# EAGLE design EPS (EAGLE 9.5.1)

## Sheet 1 of 11
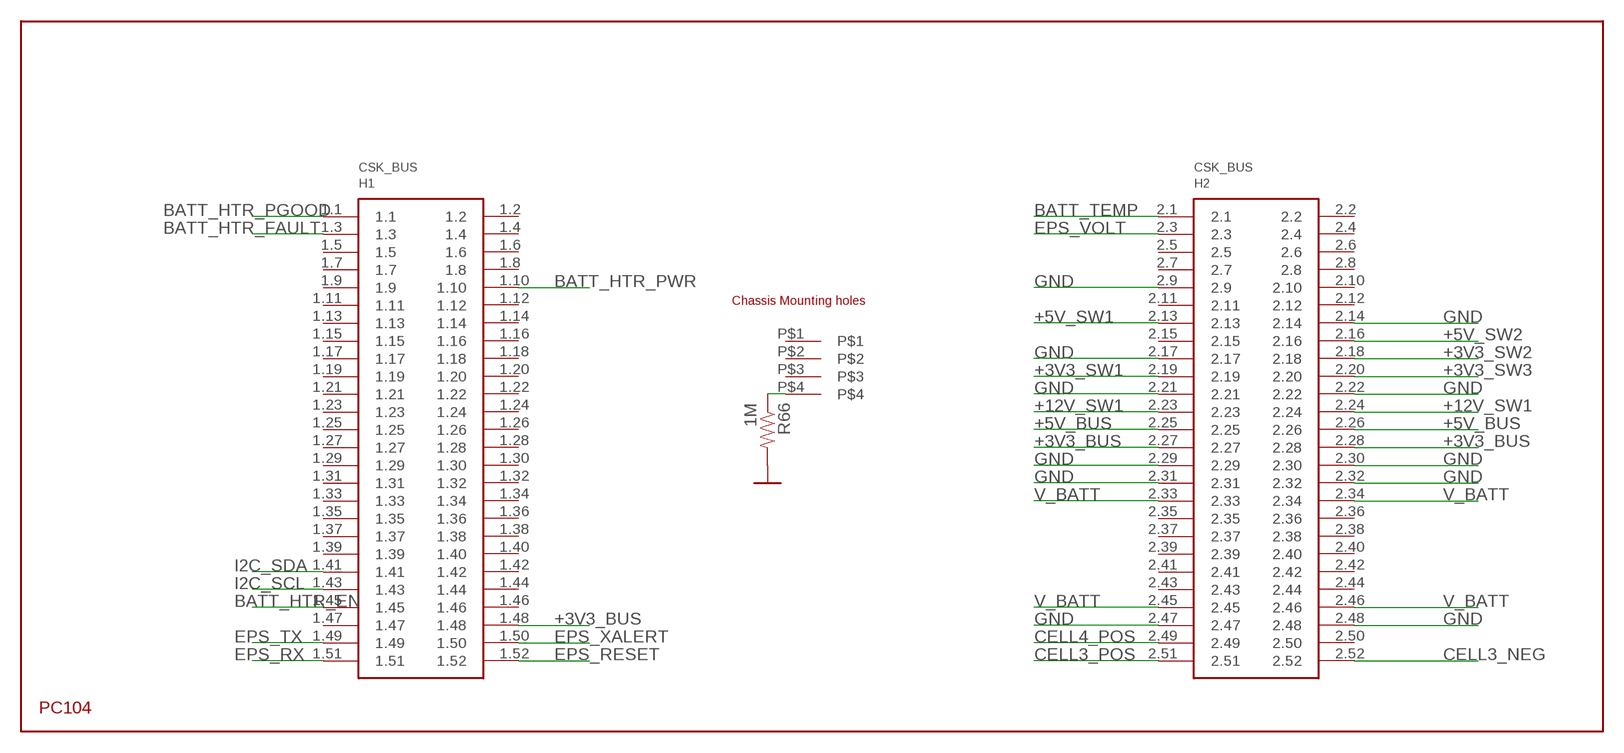
[diagram p0: schematic, sheet 1]

### Parts
H1  PC104_WCONN  [PC104_WCONN]
R66  1M  RESISTOR0805-RES  [0805]

### Nets
+3V3_BUS: H1.1.48 H1.2.27 H1.2.28 ; also sheet 6,8
+3V3_SW1: H1.2.19 ; also sheet 7
+3V3_SW2: H1.2.18 ; also sheet 10
+3V3_SW3: H1.2.20 ; also sheet 11
+5V_BUS: H1.2.25 H1.2.26 ; also sheet 4,8
+5V_SW1: H1.2.13 ; also sheet 5
+5V_SW2: H1.2.16 ; also sheet 9
+12V_SW1: H1.2.23 H1.2.24 ; also sheet 3
BATT_HTR_EN: H1.1.45 ; also sheet 8
BATT_HTR_FAULT: H1.1.3 ; also sheet 8
BATT_HTR_PGOOD: H1.1.1 ; also sheet 8
BATT_HTR_PWR: H1.1.10
BATT_TEMP: H1.2.1 ; also sheet 8
CELL3_NEG: H1.2.52
CELL3_POS: H1.2.51
CELL4_POS: H1.2.49
EPS_RESET: H1.1.52 ; also sheet 8
EPS_RX: H1.1.51 ; also sheet 8
EPS_TX: H1.1.49 ; also sheet 8
EPS_VOLT: H1.2.3 ; also sheet 8
EPS_XALERT: H1.1.50 ; also sheet 8
GND: H1.2.9 H1.2.14 H1.2.17 H1.2.21 H1.2.22 H1.2.29 H1.2.30 H1.2.31 H1.2.32 H1.2.47 H1.2.48 R66.2 ; also sheet 2,3,4,5,6,7,8,9,10,11
I2C_SCL: H1.1.43 ; also sheet 8
I2C_SDA: H1.1.41 ; also sheet 8
N$94: H1.P$4 R66.1
V_BATT: H1.2.33 H1.2.34 H1.2.45 H1.2.46 ; also sheet 2,3,4,5,6,7,9,10,11
Unconnected: H1.1.2 H1.1.4 H1.1.5 H1.1.6 H1.1.7 H1.1.8 H1.1.9 H1.1.11 H1.1.12 H1.1.13 H1.1.14 H1.1.15 H1.1.16 H1.1.17 H1.1.18 H1.1.19 H1.1.20 H1.1.21 H1.1.22 H1.1.23 H1.1.24 H1.1.25 H1.1.26 H1.1.27 H1.1.28 H1.1.29 H1.1.30 H1.1.31 H1.1.32 H1.1.33 H1.1.34 H1.1.35 H1.1.36 H1.1.37 H1.1.38 H1.1.39 H1.1.40 H1.1.42 H1.1.44 H1.1.46 H1.1.47 H1.2.2 H1.2.4 H1.2.5 H1.2.6 H1.2.7 H1.2.8 H1.2.10 H1.2.11 H1.2.12 H1.2.15 H1.2.35 H1.2.36 H1.2.37 H1.2.38 H1.2.39 H1.2.40 H1.2.41 H1.2.42 H1.2.43 H1.2.44 H1.2.50 H1.P$1 H1.P$2 H1.P$3

## Sheet 2 of 11
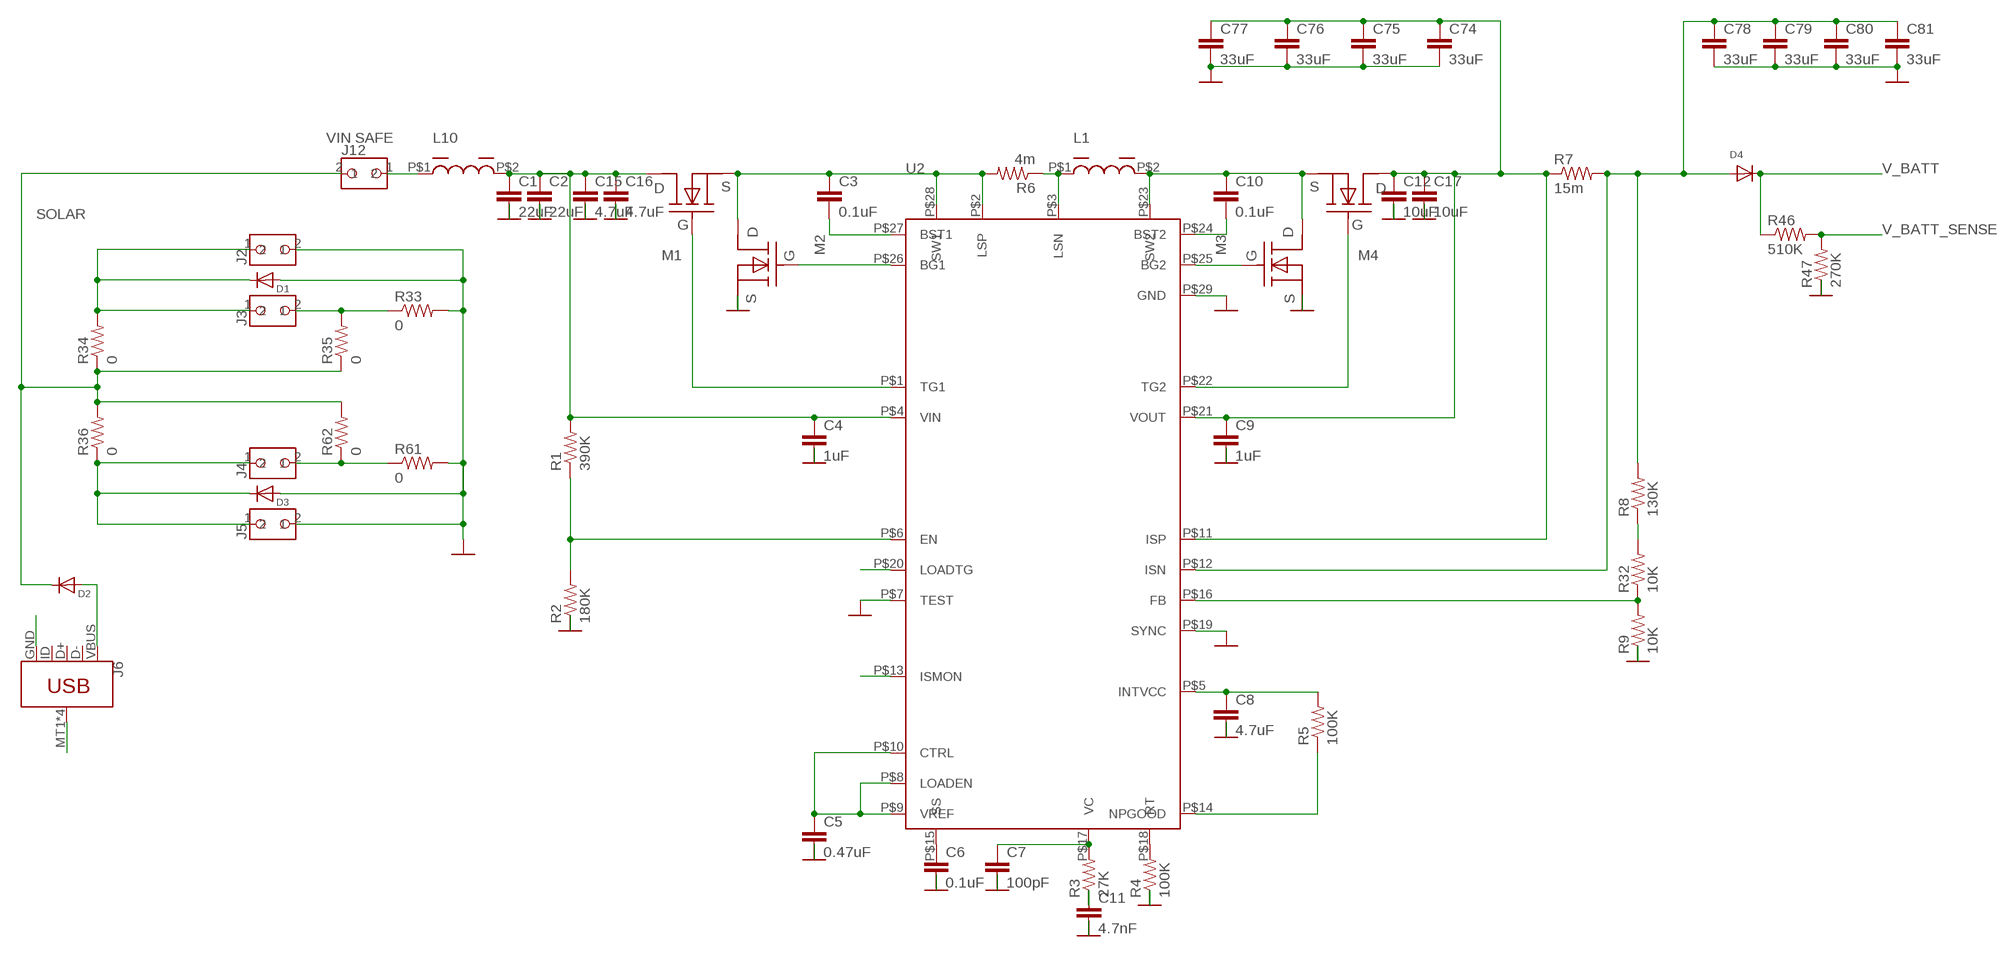
[diagram p1: schematic, sheet 2]

### Parts
C1  22uF  CAP0805  [0805]
C2  22uF  CAP0805  [0805]
C3  0.1uF  CAP0805  [0805]
C4  1uF  CAP0805  [0805]
C5  0.47uF  CAP0805  [0805]
C6  0.1uF  CAP0805  [0805]
C7  100pF  CAP0805  [0805]
C8  4.7uF  CAP0805  [0805]
C9  1uF  CAP0805  [0805]
C10  0.1uF  CAP0805  [0805]
C11  4.7nF  CAP0805  [0805]
C12  10uF  CAP0805  [0805]
C15  4.7uF  CAP0805  [0805]
C16  4.7uF  CAP0805  [0805]
C17  10uF  CAP0805  [0805]
C74  33uF  CAP1206  [1206]
C75  33uF  CAP1206  [1206]
C76  33uF  CAP1206  [1206]
C77  33uF  CAP1206  [1206]
C78  33uF  CAP1206  [1206]
C79  33uF  CAP1206  [1206]
C80  33uF  CAP1206  [1206]
C81  33uF  CAP1206  [1206]
D1  DIODE_SOD-123FL  [SOD-123FL]
D2  DIODE_SOD-123FL  [SOD-123FL]
D3  DIODE_SOD-123FL  [SOD-123FL]
D4  DIODE_SOD-123FL  [SOD-123FL]
J2  2PIN_HEADER  [2MM_2PIN_HEADER]
J3  2PIN_HEADER  [2MM_2PIN_HEADER]
J4  2PIN_HEADER  [2MM_2PIN_HEADER]
J5  2PIN_HEADER  [2MM_2PIN_HEADER]
J6  USB_MICRO-B_SMT  [USB-MICROB]
J12  2PIN_HEADER  [2MM_2PIN_HEADER]
L1  6uH  7443551600  [7443551600]
L10  6uH  7443551600  [7443551600]
M1  BSZ100N06LS3  [BSZ100N06LS3]
M2  BSZ100N06LS3  [BSZ100N06LS3]
M3  BSZ033NE2LS5  BSZ100N06LS3  [BSZ100N06LS3]
M4  BSZ033NE2LS5  BSZ100N06LS3  [BSZ100N06LS3]
R1  390K  RESISTOR0805-RES  [0805]
R2  180K  RESISTOR0805-RES  [0805]
R3  27K  RESISTOR0805-RES  [0805]
R4  100K  RESISTOR0805-RES  [0805]
R5  100K  RESISTOR0805-RES  [0805]
R6  4m  RESISTOR0805-RES  [0805]
R7  15m  RESISTOR0805-RES  [0805]
R8  130K  RESISTOR0805-RES  [0805]
R9  10K  RESISTOR0805-RES  [0805]
R32  10K  RESISTOR0805-RES  [0805]
R33  0  RESISTOR0603-RES  [0603-RES]
R34  0  RESISTOR0603-RES  [0603-RES]
R35  0  RESISTOR0603-RES  [0603-RES]
R36  0  RESISTOR0603-RES  [0603-RES]
R46  510K  RESISTOR0805-RES  [0805]
R47  270K  RESISTOR0805-RES  [0805]
R61  0  RESISTOR0603-RES  [0603-RES]
R62  0  RESISTOR0603-RES  [0603-RES]
U2  LT8390UFD  [LT8390UFD]

### Nets
GND: C1.2 C2.2 C4.2 C5.2 C6.2 C7.2 C8.2 C9.2 C11.2 C12.2 C15.2 C16.2 C17.2 C74.2 C75.2 C76.2 C77.2 C78.2 C79.2 C80.2 C81.2 D1.A D3.A J2.2 J5.2 J6.GND J6.MT1(SHIELD) J6.MT2(SHIELD) J6.P$1(SHIELD) J6.P$2(SHIELD) M2.P$2(S) M2.P$3(S) M2.P$4(S) M3.P$2(S) M3.P$3(S) M3.P$4(S) R2.1 R4.1 R9.1 R33.2 R47.1 R61.2 U2.P$7(TEST) U2.P$19(SYNC) U2.P$29(GND) ; also sheet 1,3,4,5,6,7,8,9,10,11
N$1: C3.1 M1.P$2(S) M1.P$3(S) M1.P$4(S) M2.P$5(D) M2.P$6(D) M2.P$7(D) M2.P$8(D) M2.P$9(D) R6.2 U2.P$2(LSP) U2.P$28(SW1)
N$2: C3.2 U2.P$27(BST1)
N$15: R8.1 R32.2
N$17: M2.P$1(G) U2.P$26(BG1)
N$34: M1.P$1(G) U2.P$1(TG1)
N$35: M3.P$1(G) U2.P$25(BG2)
N$36: R1.1 R2.2 U2.P$6(EN)
N$37: U2.P$20(LOADTG)
N$38: U2.P$13(ISMON)
N$39: C5.1 U2.P$8(LOADEN) U2.P$9(VREF) U2.P$10(CTRL)
N$40: C6.1 U2.P$15(SS)
N$41: C7.1 R3.2 U2.P$17(VC)
N$42: R4.2 U2.P$18(RT)
N$43: R5.1 U2.P$14(NPGOOD)
N$44: C8.1 R5.2 U2.P$5(INTVCC)
N$45: L1.P$1 R6.1 U2.P$3(LSN)
N$46: C10.1 L1.P$2 M3.P$5(D) M3.P$6(D) M3.P$7(D) M3.P$8(D) M3.P$9(D) M4.P$2(S) M4.P$3(S) M4.P$4(S) U2.P$23(SW2)
N$47: C10.2 U2.P$24(BST2)
N$48: C9.1 C12.1 C17.1 C74.1 C75.1 C76.1 C77.1 M4.P$5(D) M4.P$6(D) M4.P$7(D) M4.P$8(D) M4.P$9(D) R7.1 U2.P$11(ISP) U2.P$21(VOUT)
N$49: M4.P$1(G) U2.P$22(TG2)
N$50: J12.1 L10.P$1
N$51: R9.2 R32.1 U2.P$16(FB)
N$52: D1.C J2.1 J3.1 R34.2
N$53: J3.2 R33.1 R35.2
N$55: C11.1 R3.1
N$57: J4.2 R61.1 R62.1
N$58: D2.A J6.VBUS
N$85: C1.1 C2.1 C4.1 C15.1 C16.1 L10.P$2 M1.P$5(D) M1.P$6(D) M1.P$7(D) M1.P$8(D) M1.P$9(D) R1.2 U2.P$4(VIN)
N$99: D3.C J4.1 J5.1 R36.1
SOLAR: D2.C J12.2 R34.1 R35.1 R36.2 R62.2
V_BATT: C78.1 C79.1 C80.1 C81.1 D4.A D4.C R7.2 R8.2 R46.1 U2.P$12(ISN) ; also sheet 1,3,4,5,6,7,9,10,11
V_BATT_SENSE: R46.2 R47.2 ; also sheet 8
Unconnected: J6.D+ J6.D- J6.ID

### Notes on the sheet
- VIN SAFE

## Sheet 3 of 11
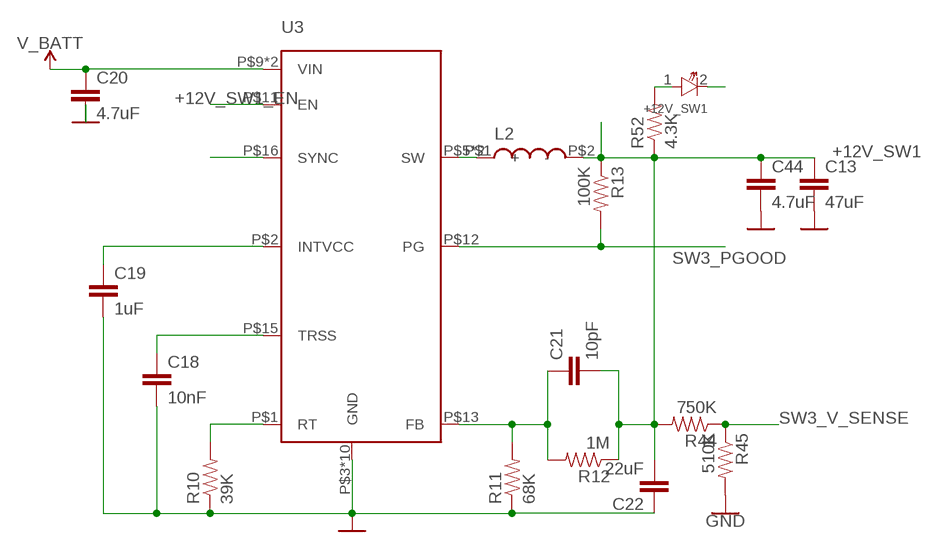
[diagram p2: schematic, sheet 3]

### Parts
+12V_SW1  LED_0805  [LED_0805]
C13  47uF  CAP1206  [1206]
C18  10nF  CAP0805  [0805]
C19  1uF  CAP0805  [0805]
C20  4.7uF  CAP0805  [0805]
C21  10pF  CAP0805  [0805]
C22  22uF  CAP0805  [0805]
C44  4.7uF  CAP0805  [0805]
L2  10uH  XAL4040-103ME  [XAL4040-103ME]
R10  39K  RESISTOR0805-RES  [0805]
R11  68K  RESISTOR0805-RES  [0805]
R12  1M  RESISTOR0805-RES  [0805]
R13  100K  RESISTOR0805-RES  [0805]
R44  750K  RESISTOR0805-RES  [0805]
R45  510K  RESISTOR0805-RES  [0805]
R52  4.3K  RESISTOR0805-RES  [0805]
U3  LT8609S  [LT8609S]

### Nets
+12V_SW1: C13.1 C21.2 C22.2 C44.1 L2.P$2(-) R12.1 R13.1 R44.2 R52.1 ; also sheet 1
+12V_SW1_EN: U3.P$11(EN) ; also sheet 8
GND: +12V_SW1.2 C13.2 C18.2 C19.2 C20.2 C22.1 C44.2 R10.1 R11.1 R45.2 U3.P$3(GND) U3.P$4(GND) U3.P$7(GND) U3.P$8(GND) U3.P$14(GND) U3.P$17(GND) U3.P$18(GND) U3.P$19(GND) U3.P$20(GND) U3.P$21(GND) ; also sheet 1,2,4,5,6,7,8,9,10,11
N$4: L2.P$1(+) U3.P$5(SW) U3.P$6(SW)
N$5: U3.P$16(SYNC)
N$6: R10.2 U3.P$1(RT)
N$7: C21.1 R11.2 R12.2 U3.P$13(FB)
N$9: C19.1 U3.P$2(INTVCC)
N$10: C18.1 U3.P$15(TRSS)
N$56: +12V_SW1.1 R52.2
SW3_PGOOD: R13.2 U3.P$12(PG)
SW3_V_SENSE: R44.1 R45.1 ; also sheet 8
V_BATT: C20.1 U3.P$9(VIN) U3.P$10(VIN) ; also sheet 1,2,4,5,6,7,9,10,11

## Sheet 4 of 11
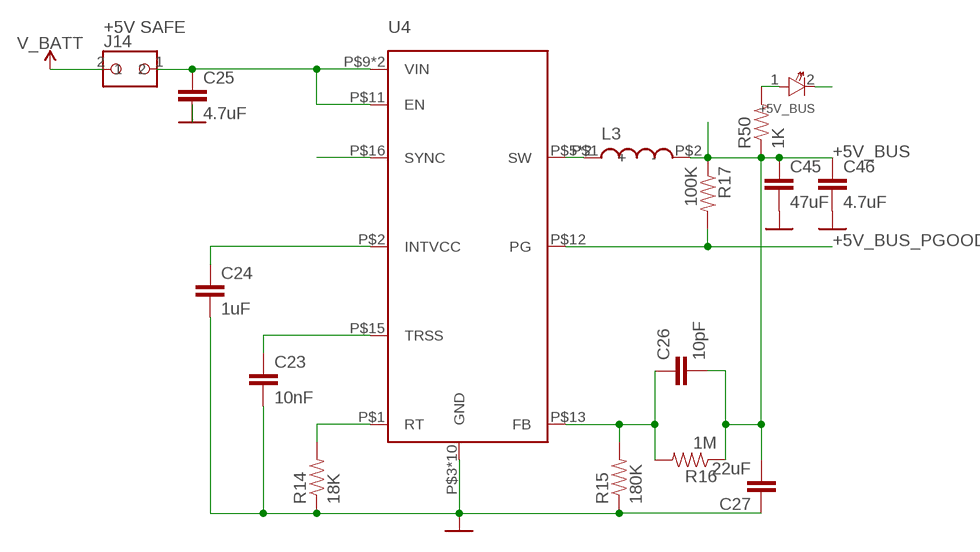
[diagram p3: schematic, sheet 4]

### Parts
+5V_BUS  LED_0805  [LED_0805]
C23  10nF  CAP0805  [0805]
C24  1uF  CAP0805  [0805]
C25  4.7uF  CAP0805  [0805]
C26  10pF  CAP0805  [0805]
C27  22uF  CAP0805  [0805]
C45  47uF  CAP0805  [0805]
C46  4.7uF  CAP0805  [0805]
J14  2PIN_HEADER  [2MM_2PIN_HEADER]
L3  2.2uH  XFL4020-222ME  [XAL4040-103ME]
R14  18K  RESISTOR0805-RES  [0805]
R15  180K  RESISTOR0805-RES  [0805]
R16  1M  RESISTOR0805-RES  [0805]
R17  100K  RESISTOR0805-RES  [0805]
R50  1K  RESISTOR0805-RES  [0805]
U4  LT8609S  [LT8609S]

### Nets
+5V_BUS: C26.2 C27.2 C45.1 C46.1 L3.P$2(-) R16.1 R17.1 R50.1 ; also sheet 1,8
+5V_BUS_PGOOD: R17.2 U4.P$12(PG)
GND: +5V_BUS.2 C23.2 C24.2 C25.2 C27.1 C45.2 C46.2 R14.1 R15.1 U4.P$3(GND) U4.P$4(GND) U4.P$7(GND) U4.P$8(GND) U4.P$14(GND) U4.P$17(GND) U4.P$18(GND) U4.P$19(GND) U4.P$20(GND) U4.P$21(GND) ; also sheet 1,2,3,5,6,7,8,9,10,11
N$3: U4.P$16(SYNC)
N$8: R14.2 U4.P$1(RT)
N$11: C26.1 R15.2 R16.2 U4.P$13(FB)
N$12: C24.1 U4.P$2(INTVCC)
N$13: C23.1 U4.P$15(TRSS)
N$14: L3.P$1(+) U4.P$5(SW) U4.P$6(SW)
N$60: +5V_BUS.1 R50.2
V_BATT: J14.2 ; also sheet 1,2,3,5,6,7,9,10,11
V_BUS: C25.1 J14.1 U4.P$9(VIN) U4.P$10(VIN) U4.P$11(EN) ; also sheet 6

### Notes on the sheet
- +5V SAFE

## Sheet 5 of 11
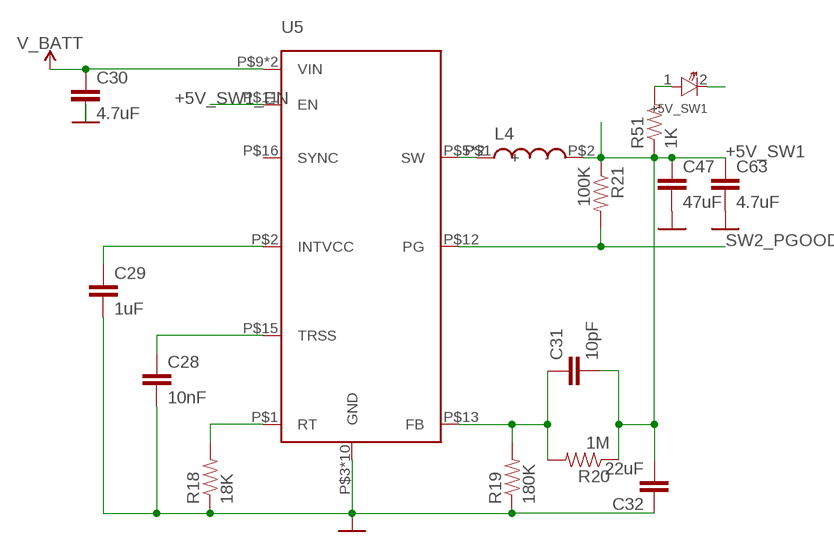
[diagram p4: schematic, sheet 5]

### Parts
+5V_SW1  LED_0805  [LED_0805]
C28  10nF  CAP0805  [0805]
C29  1uF  CAP0805  [0805]
C30  4.7uF  CAP0805  [0805]
C31  10pF  CAP0805  [0805]
C32  22uF  CAP0805  [0805]
C47  47uF  CAP0805  [0805]
C63  4.7uF  CAP0805  [0805]
L4  2.2uH  XFL4020-222ME  [XAL4040-103ME]
R18  18K  RESISTOR0805-RES  [0805]
R19  180K  RESISTOR0805-RES  [0805]
R20  1M  RESISTOR0805-RES  [0805]
R21  100K  RESISTOR0805-RES  [0805]
R51  1K  RESISTOR0805-RES  [0805]
U5  LT8609S  [LT8609S]

### Nets
+5V_SW1: C31.2 C32.2 C47.1 C63.1 L4.P$2(-) R20.1 R21.1 R51.1 ; also sheet 1
+5V_SW1_EN: U5.P$11(EN) ; also sheet 8
GND: +5V_SW1.2 C28.2 C29.2 C30.2 C32.1 C47.2 C63.2 R18.1 R19.1 U5.P$3(GND) U5.P$4(GND) U5.P$7(GND) U5.P$8(GND) U5.P$14(GND) U5.P$17(GND) U5.P$18(GND) U5.P$19(GND) U5.P$20(GND) U5.P$21(GND) ; also sheet 1,2,3,4,6,7,8,9,10,11
N$16: R18.2 U5.P$1(RT)
N$18: C31.1 R19.2 R20.2 U5.P$13(FB)
N$19: C29.1 U5.P$2(INTVCC)
N$20: C28.1 U5.P$15(TRSS)
N$21: L4.P$1(+) U5.P$5(SW) U5.P$6(SW)
N$75: +5V_SW1.1 R51.2
SW2_PGOOD: R21.2 U5.P$12(PG) ; also sheet 8
V_BATT: C30.1 U5.P$9(VIN) U5.P$10(VIN) ; also sheet 1,2,3,4,6,7,9,10,11
Unconnected: U5.P$16(SYNC)

## Sheet 6 of 11
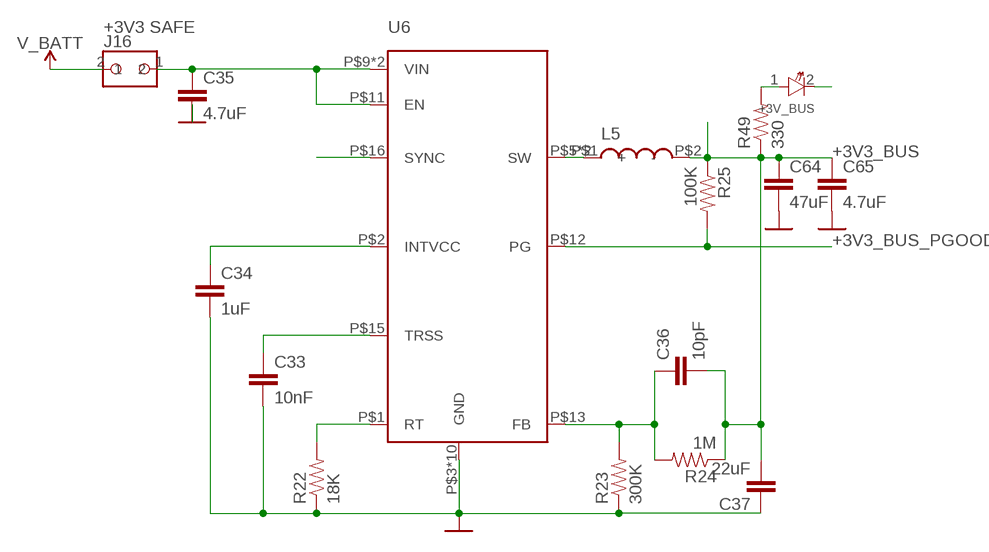
[diagram p5: schematic, sheet 6]

### Parts
+3V_BUS  LED_0805  [LED_0805]
C33  10nF  CAP0805  [0805]
C34  1uF  CAP0805  [0805]
C35  4.7uF  CAP0805  [0805]
C36  10pF  CAP0805  [0805]
C37  22uF  CAP0805  [0805]
C64  47uF  CAP0805  [0805]
C65  4.7uF  CAP0805  [0805]
J16  2PIN_HEADER  [2MM_2PIN_HEADER]
L5  2.2uH  XFL4020-222ME  [XAL4040-103ME]
R22  18K  RESISTOR0805-RES  [0805]
R23  300K  RESISTOR0805-RES  [0805]
R24  1M  RESISTOR0805-RES  [0805]
R25  100K  RESISTOR0805-RES  [0805]
R49  330  RESISTOR0805-RES  [0805]
U6  LT8609S  [LT8609S]

### Nets
+3V3_BUS: C36.2 C37.2 C64.1 C65.1 L5.P$2(-) R24.1 R25.1 R49.1 ; also sheet 1,8
+3V3_BUS_PGOOD: R25.2 U6.P$12(PG)
GND: +3V_BUS.2 C33.2 C34.2 C35.2 C37.1 C64.2 C65.2 R22.1 R23.1 U6.P$3(GND) U6.P$4(GND) U6.P$7(GND) U6.P$8(GND) U6.P$14(GND) U6.P$17(GND) U6.P$18(GND) U6.P$19(GND) U6.P$20(GND) U6.P$21(GND) ; also sheet 1,2,3,4,5,7,8,9,10,11
N$22: U6.P$16(SYNC)
N$23: R22.2 U6.P$1(RT)
N$24: C36.1 R23.2 R24.2 U6.P$13(FB)
N$25: C34.1 U6.P$2(INTVCC)
N$26: C33.1 U6.P$15(TRSS)
N$27: L5.P$1(+) U6.P$5(SW) U6.P$6(SW)
N$84: +3V_BUS.1 R49.2
V_BATT: J16.2 ; also sheet 1,2,3,4,5,7,9,10,11
V_BUS: C35.1 J16.1 U6.P$9(VIN) U6.P$10(VIN) U6.P$11(EN) ; also sheet 4

### Notes on the sheet
- +3V3 SAFE

## Sheet 7 of 11
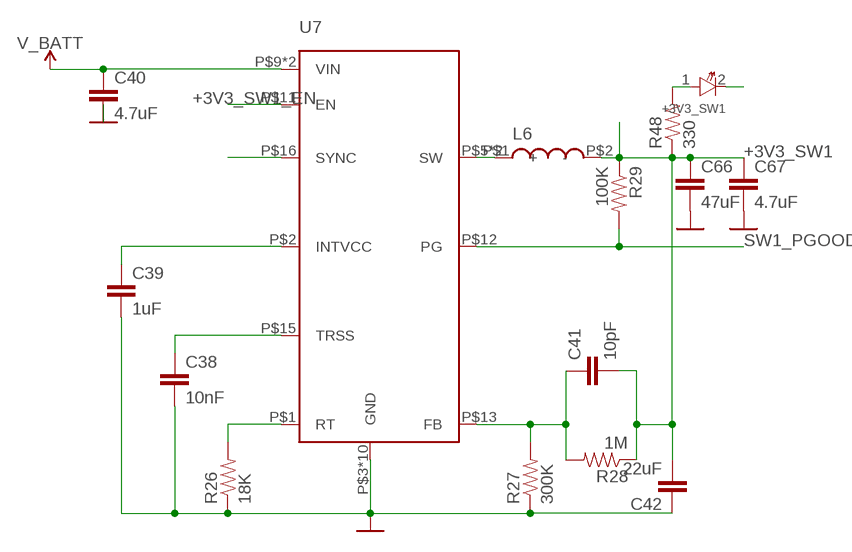
[diagram p6: schematic, sheet 7]

### Parts
+3V3_SW1  LED_0805  [LED_0805]
C38  10nF  CAP0805  [0805]
C39  1uF  CAP0805  [0805]
C40  4.7uF  CAP0805  [0805]
C41  10pF  CAP0805  [0805]
C42  22uF  CAP0805  [0805]
C66  47uF  CAP0805  [0805]
C67  4.7uF  CAP0805  [0805]
L6  2.2uH  XFL4020-222ME  [XAL4040-103ME]
R26  18K  RESISTOR0805-RES  [0805]
R27  300K  RESISTOR0805-RES  [0805]
R28  1M  RESISTOR0805-RES  [0805]
R29  100K  RESISTOR0805-RES  [0805]
R48  330  RESISTOR0805-RES  [0805]
U7  LT8609S  [LT8609S]

### Nets
+3V3_SW1: C41.2 C42.2 C66.1 C67.1 L6.P$2(-) R28.1 R29.1 R48.1 ; also sheet 1
+3V3_SW1_EN: U7.P$11(EN) ; also sheet 8
GND: +3V3_SW1.2 C38.2 C39.2 C40.2 C42.1 C66.2 C67.2 R26.1 R27.1 U7.P$3(GND) U7.P$4(GND) U7.P$7(GND) U7.P$8(GND) U7.P$14(GND) U7.P$17(GND) U7.P$18(GND) U7.P$19(GND) U7.P$20(GND) U7.P$21(GND) ; also sheet 1,2,3,4,5,6,8,9,10,11
N$28: U7.P$16(SYNC)
N$29: R26.2 U7.P$1(RT)
N$30: C41.1 R27.2 R28.2 U7.P$13(FB)
N$31: C39.1 U7.P$2(INTVCC)
N$32: C38.1 U7.P$15(TRSS)
N$33: L6.P$1(+) U7.P$5(SW) U7.P$6(SW)
N$54: +3V3_SW1.1 R48.2
SW1_PGOOD: R29.2 U7.P$12(PG) ; also sheet 8
V_BATT: C40.1 U7.P$9(VIN) U7.P$10(VIN) ; also sheet 1,2,3,4,5,6,9,10,11

## Sheet 8 of 11
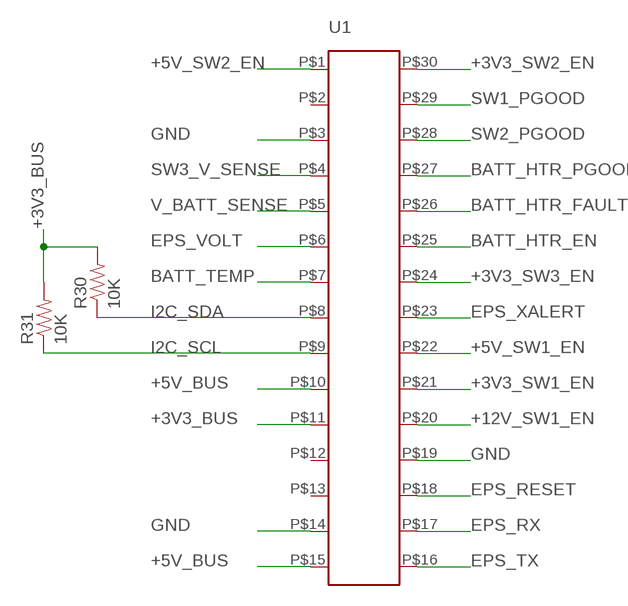
[diagram p7: schematic, sheet 8]

### Parts
R30  10K  RESISTOR0805-RES  [0805]
R31  10K  RESISTOR0805-RES  [0805]
U1  ARDUINO_EVERY_NANO_PAD  [ARDUINO_EVERY_NANO]

### Nets
+3V3_BUS: R30.2 R31.2 U1.P$11 ; also sheet 1,6
+3V3_SW1_EN: U1.P$21 ; also sheet 7
+3V3_SW2_EN: U1.P$30 ; also sheet 10
+3V3_SW3_EN: U1.P$24 ; also sheet 11
+5V_BUS: U1.P$10 U1.P$15 ; also sheet 1,4
+5V_SW1_EN: U1.P$22 ; also sheet 5
+5V_SW2_EN: U1.P$1 ; also sheet 9
+12V_SW1_EN: U1.P$20 ; also sheet 3
BATT_HTR_EN: U1.P$25 ; also sheet 1
BATT_HTR_FAULT: U1.P$26 ; also sheet 1
BATT_HTR_PGOOD: U1.P$27 ; also sheet 1
BATT_TEMP: U1.P$7 ; also sheet 1
EPS_RESET: U1.P$18 ; also sheet 1
EPS_RX: U1.P$17 ; also sheet 1
EPS_TX: U1.P$16 ; also sheet 1
EPS_VOLT: U1.P$6 ; also sheet 1
EPS_XALERT: U1.P$23 ; also sheet 1
GND: U1.P$3 U1.P$14 U1.P$19 ; also sheet 1,2,3,4,5,6,7,9,10,11
I2C_SCL: R31.1 U1.P$9 ; also sheet 1
I2C_SDA: R30.1 U1.P$8 ; also sheet 1
SW1_PGOOD: U1.P$29 ; also sheet 7
SW2_PGOOD: U1.P$28 ; also sheet 5
SW3_V_SENSE: U1.P$4 ; also sheet 3
V_BATT_SENSE: U1.P$5 ; also sheet 2
Unconnected: U1.P$2 U1.P$12 U1.P$13

## Sheet 9 of 11
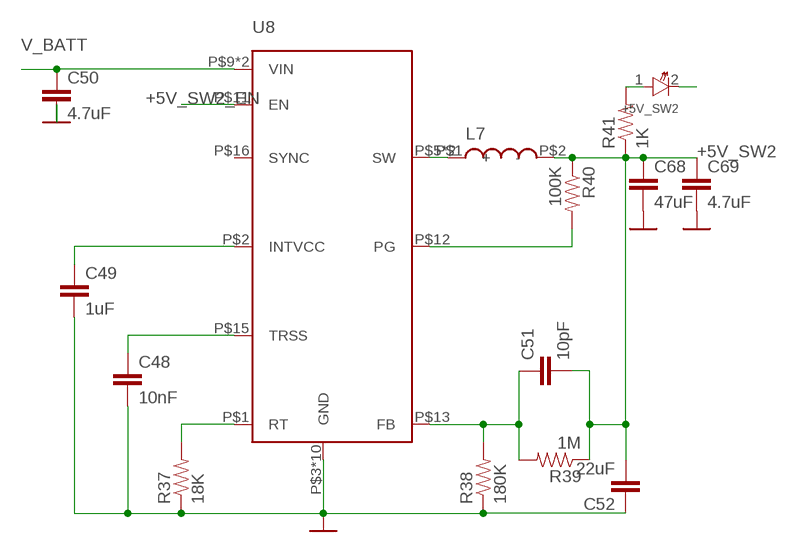
[diagram p8: schematic, sheet 9]

### Parts
+5V_SW2  LED_0805  [LED_0805]
C48  10nF  CAP0805  [0805]
C49  1uF  CAP0805  [0805]
C50  4.7uF  CAP0805  [0805]
C51  10pF  CAP0805  [0805]
C52  22uF  CAP0805  [0805]
C68  47uF  CAP0805  [0805]
C69  4.7uF  CAP0805  [0805]
L7  2.2uH  XFL4020-222ME  [XAL4040-103ME]
R37  18K  RESISTOR0805-RES  [0805]
R38  180K  RESISTOR0805-RES  [0805]
R39  1M  RESISTOR0805-RES  [0805]
R40  100K  RESISTOR0805-RES  [0805]
R41  1K  RESISTOR0805-RES  [0805]
U8  LT8609S  [LT8609S]

### Nets
+5V_SW2: C51.2 C52.2 C68.1 C69.1 L7.P$2(-) R39.1 R40.1 R41.1 ; also sheet 1
+5V_SW2_EN: U8.P$11(EN) ; also sheet 8
+5V_SW2_PGOOD: R40.2 U8.P$12(PG)
GND: +5V_SW2.2 C48.2 C49.2 C50.2 C52.1 C68.2 C69.2 R37.1 R38.1 U8.P$3(GND) U8.P$4(GND) U8.P$7(GND) U8.P$8(GND) U8.P$14(GND) U8.P$17(GND) U8.P$18(GND) U8.P$19(GND) U8.P$20(GND) U8.P$21(GND) ; also sheet 1,2,3,4,5,6,7,8,10,11
N$59: R37.2 U8.P$1(RT)
N$61: C51.1 R38.2 R39.2 U8.P$13(FB)
N$62: C49.1 U8.P$2(INTVCC)
N$63: C48.1 U8.P$15(TRSS)
N$64: L7.P$1(+) U8.P$5(SW) U8.P$6(SW)
N$65: +5V_SW2.1 R41.2
V_BATT: C50.1 U8.P$9(VIN) U8.P$10(VIN) ; also sheet 1,2,3,4,5,6,7,10,11
Unconnected: U8.P$16(SYNC)

## Sheet 10 of 11
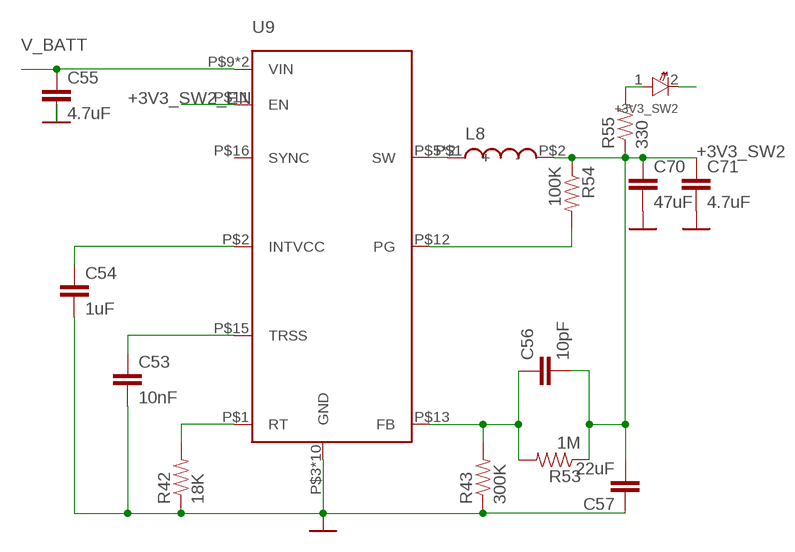
[diagram p9: schematic, sheet 10]

### Parts
+3V3_SW2  LED_0805  [LED_0805]
C53  10nF  CAP0805  [0805]
C54  1uF  CAP0805  [0805]
C55  4.7uF  CAP0805  [0805]
C56  10pF  CAP0805  [0805]
C57  22uF  CAP0805  [0805]
C70  47uF  CAP0805  [0805]
C71  4.7uF  CAP0805  [0805]
L8  2.2uH  XFL4020-222ME  [XAL4040-103ME]
R42  18K  RESISTOR0805-RES  [0805]
R43  300K  RESISTOR0805-RES  [0805]
R53  1M  RESISTOR0805-RES  [0805]
R54  100K  RESISTOR0805-RES  [0805]
R55  330  RESISTOR0805-RES  [0805]
U9  LT8609S  [LT8609S]

### Nets
+3V3_SW2: C56.2 C57.2 C70.1 C71.1 L8.P$2(-) R53.1 R54.1 R55.1 ; also sheet 1
+3V3_SW2_EN: U9.P$11(EN) ; also sheet 8
+3V3_SW2_PGOOD: R54.2 U9.P$12(PG)
GND: +3V3_SW2.2 C53.2 C54.2 C55.2 C57.1 C70.2 C71.2 R42.1 R43.1 U9.P$3(GND) U9.P$4(GND) U9.P$7(GND) U9.P$8(GND) U9.P$14(GND) U9.P$17(GND) U9.P$18(GND) U9.P$19(GND) U9.P$20(GND) U9.P$21(GND) ; also sheet 1,2,3,4,5,6,7,8,9,11
N$66: R42.2 U9.P$1(RT)
N$67: C56.1 R43.2 R53.2 U9.P$13(FB)
N$68: C54.1 U9.P$2(INTVCC)
N$69: C53.1 U9.P$15(TRSS)
N$70: L8.P$1(+) U9.P$5(SW) U9.P$6(SW)
N$71: +3V3_SW2.1 R55.2
V_BATT: C55.1 U9.P$9(VIN) U9.P$10(VIN) ; also sheet 1,2,3,4,5,6,7,9,11
Unconnected: U9.P$16(SYNC)

## Sheet 11 of 11
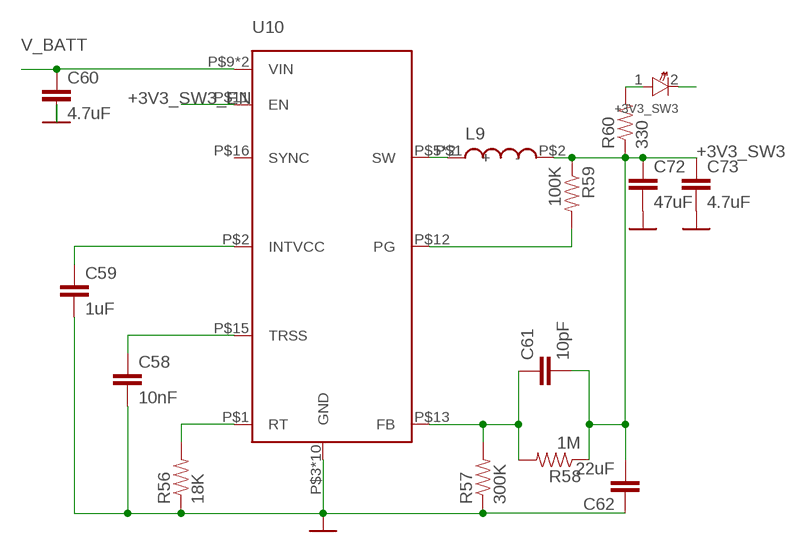
[diagram p10: schematic, sheet 11]

### Parts
+3V3_SW3  LED_0805  [LED_0805]
C58  10nF  CAP0805  [0805]
C59  1uF  CAP0805  [0805]
C60  4.7uF  CAP0805  [0805]
C61  10pF  CAP0805  [0805]
C62  22uF  CAP0805  [0805]
C72  47uF  CAP0805  [0805]
C73  4.7uF  CAP0805  [0805]
L9  2.2uH  XFL4020-222ME  [XAL4040-103ME]
R56  18K  RESISTOR0805-RES  [0805]
R57  300K  RESISTOR0805-RES  [0805]
R58  1M  RESISTOR0805-RES  [0805]
R59  100K  RESISTOR0805-RES  [0805]
R60  330  RESISTOR0805-RES  [0805]
U10  LT8609S  [LT8609S]

### Nets
+3V3_SW3: C61.2 C62.2 C72.1 C73.1 L9.P$2(-) R58.1 R59.1 R60.1 ; also sheet 1
+3V3_SW3_EN: U10.P$11(EN) ; also sheet 8
+3V3_SW3_PGOOD: R59.2 U10.P$12(PG)
GND: +3V3_SW3.2 C58.2 C59.2 C60.2 C62.1 C72.2 C73.2 R56.1 R57.1 U10.P$3(GND) U10.P$4(GND) U10.P$7(GND) U10.P$8(GND) U10.P$14(GND) U10.P$17(GND) U10.P$18(GND) U10.P$19(GND) U10.P$20(GND) U10.P$21(GND) ; also sheet 1,2,3,4,5,6,7,8,9,10
N$72: R56.2 U10.P$1(RT)
N$73: C61.1 R57.2 R58.2 U10.P$13(FB)
N$74: C59.1 U10.P$2(INTVCC)
N$76: C58.1 U10.P$15(TRSS)
N$77: L9.P$1(+) U10.P$5(SW) U10.P$6(SW)
N$78: +3V3_SW3.1 R60.2
V_BATT: C60.1 U10.P$9(VIN) U10.P$10(VIN) ; also sheet 1,2,3,4,5,6,7,9,10
Unconnected: U10.P$16(SYNC)

## Library data of the parts
+3V3_SW1-+3V3_SW3 +3V_BUS +5V_BUS +5V_SW1 +5V_SW2 +12V_SW1 = HSFL_Main_Library:LED_0805
C1-C13 C15-C42 C44-C81 = HSFL_Main_Library:CAP: Capacitor Standard 0603 ceramic capacitor, and 0.1" leaded capacitor.
D1-D4 = adafruit:DIODE: Diode SMADIODE - SMA Surface Mount Package 20V 1A Schottky Diode Digikey: 641-1014-6-ND DO-1N4148 - Through Hole Small Current Diode SOD-123 20V 1 A (.5mV Vf) Schottky Diode - Digikey: MBRX120TPMSCT-ND SOD-323 10V 570mA (.38mV Vf, 3ns) Schottky Diode - Digikey: ZLLS410CT-ND SOD-523 30V 30mA Schottky Diode (RB751S-40TE61) - Digikey: RB751S-40TE61CT-ND SOT23-R/W - SOT23 Package (R = Solder Paste/Reflow Ovens, W = Hand-Soldering) BAT54Film 40V 300mA - Digikey: 497-7162-1-ND
H1 = HSFL_Main_Library:PC104_WCONN
J2-J5 J12 J14 J16 = HSFL_Main_Library:2PIN_HEADER
J6 = SparkFun-Connectors:USB_MICRO-B: USB Type Micro-B Connector Male/female and PTH/SMT variants SparkFun Products: SparkFun microB USB Breakout <https://www.sparkfun.com/products/12035> SparkFun USB microB Plug Breakout <https://www.sparkfun.com/products/10031> SparkFun ESP8266 Thing <https://www.sparkfun.com/products/13231>; PROD_ID: CONN-09505; SF_ID: PRT-08533
L1 L10 = HSFL_Main_Library:7443551600
L2 = HSFL_Main_Library:XAL4040-103ME
L3-L9 = HSFL_Main_Library:XFL4020-222ME
M1-M4 = HSFL_Main_Library:BSZ100N06LS3
R1-R62 R66 = HSFL_Main_Library:RESISTOR: Resistor Basic schematic elements and footprints for 0603, 1206, and PTH resistors.
U1 = HSFL_Main_Library:ARDUINO_EVERY_NANO_PAD
U2 = HSFL_Main_Library:LT8390UFD
U3-U10 = HSFL_Main_Library:LT8609S

## Net classes
0 default: width 0.19 mm, drill 0.19 mm

## Board
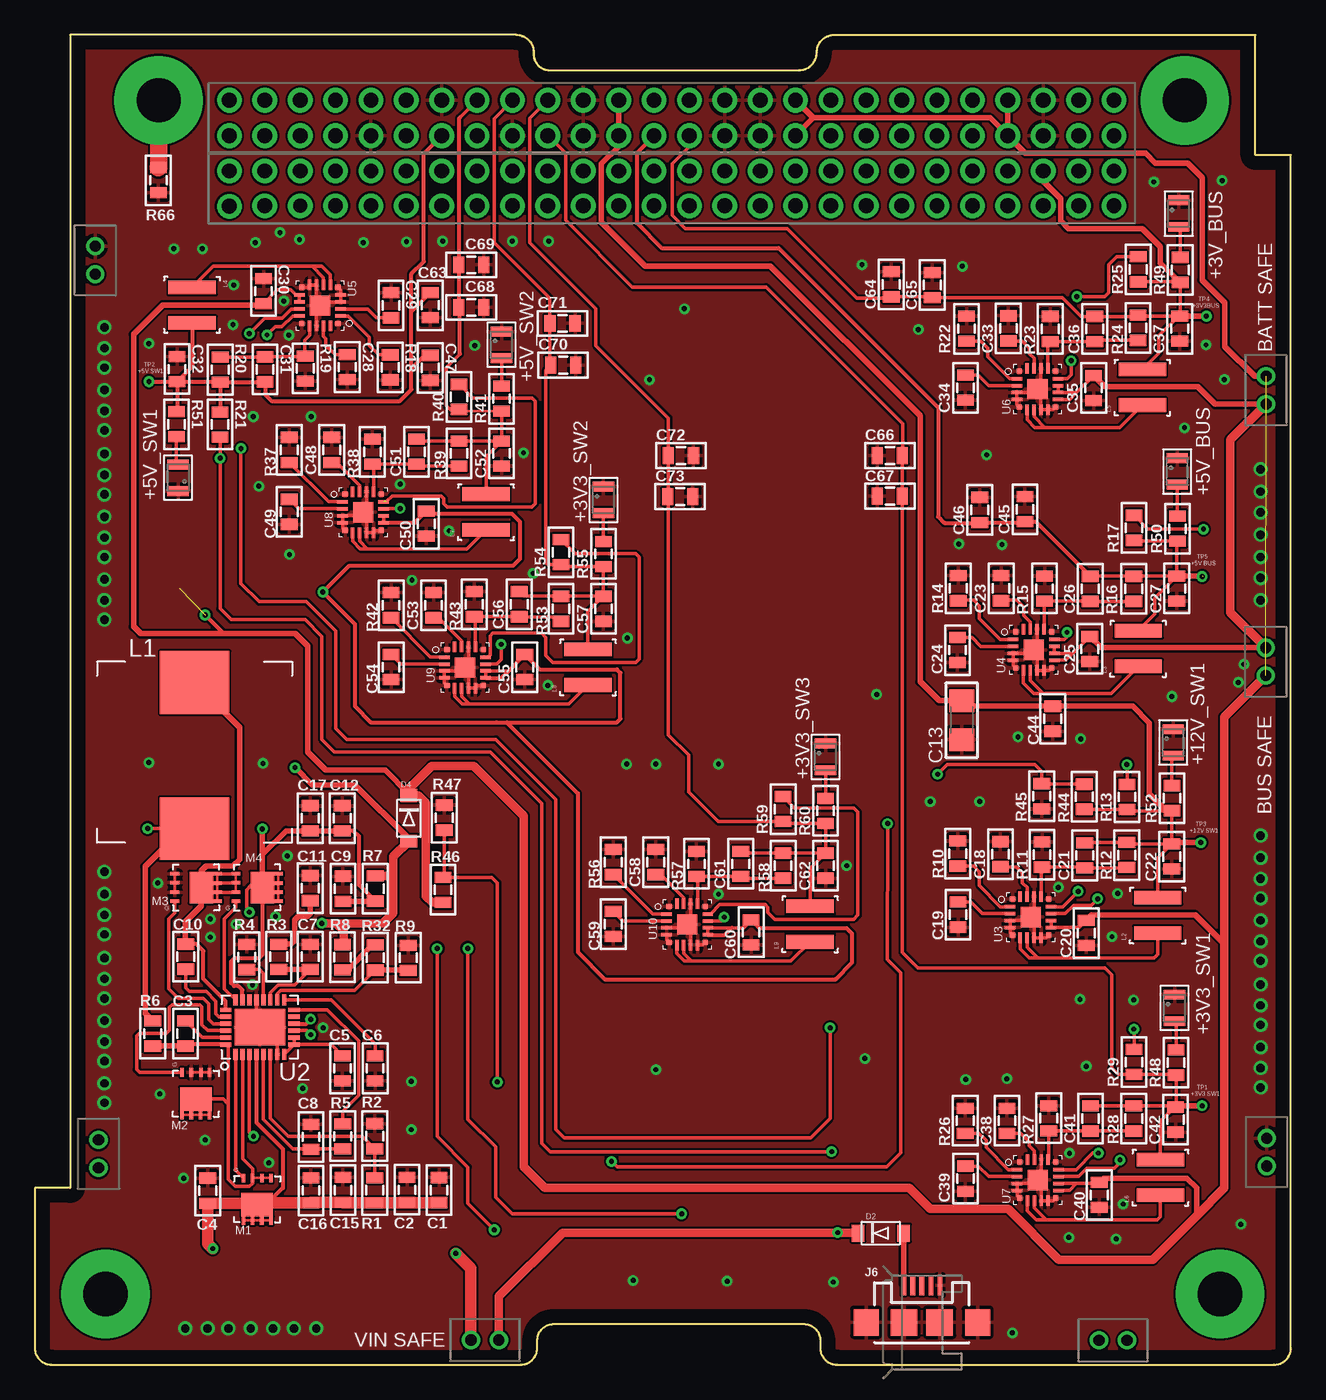
[diagram p11: board, top side]
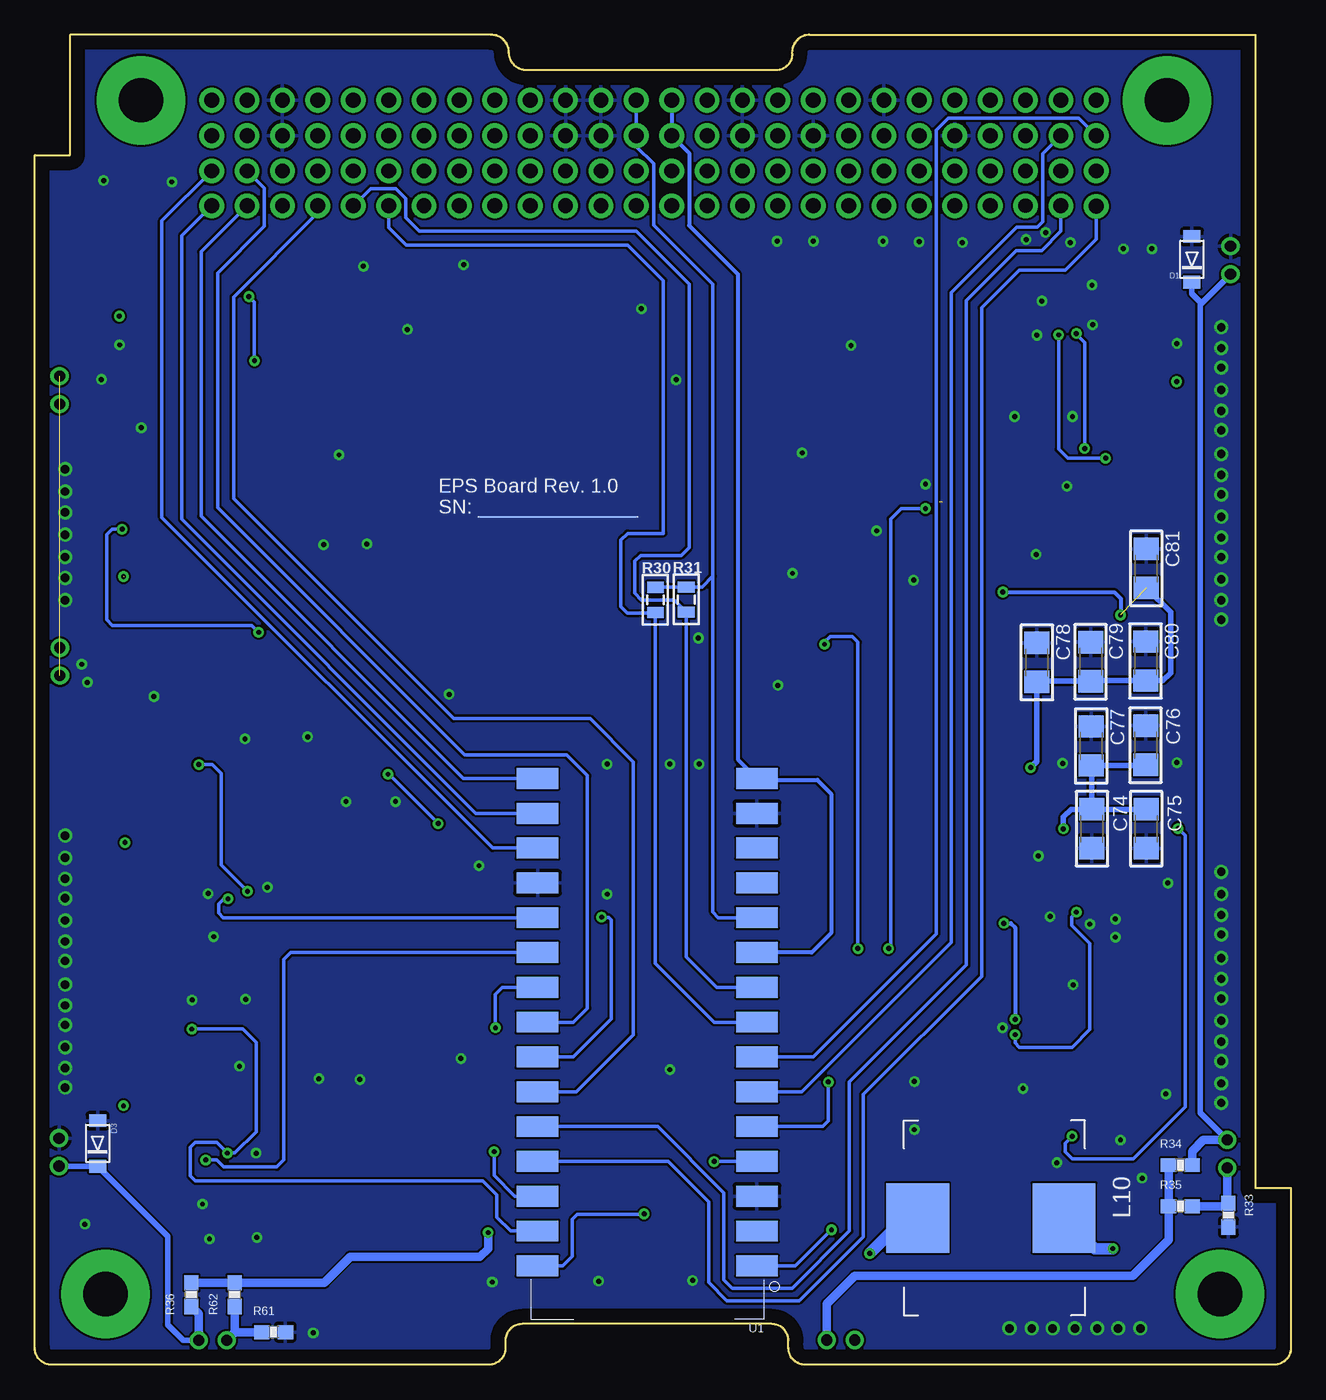
[diagram p12: board, bottom side, seen from below]

Size 90.17 x 95.5 mm. Coordinates in mm from the lower left corner, seen from the top.
Copper layers (1*16): Top 0.035mm / dielectric 1.5mm / Bottom 0.035mm
Design rules "default": minimum track width 6mil, minimum drill 0.35mm, track to track 6mil, track to pad 6mil, pad to pad 6mil, via to via 6mil, smd to smd 6mil, copper to edge 40mil, drill to drill 6mil, minimum pad ring 10mil, minimum via ring 8mil, stop-mask expansion 4mil, vias tented up to drill 0mil, thermal gap 10mil

### Footprints (pad centres in the part's own frame; a part is rotated, then mirrored left to right if it is on the bottom)
LED_0805 = smd 0.711 x 1.524: 1 0,0; 2 1.905,0
0805 = smd 0.8 x 1.2: 1 -0.9,0; 2 0.9,0
1206 = smd 1.6 x 1.8: 1 -1.4,0; 2 1.4,0
SOD-123FL = smd 0.91 x 1.22: A 1.637,0; C -1.637,0
PC104_WCONN = drill 1.067 pad 1.778: 1.1 13.97,83.185; 1.2 13.97,85.725; 1.3 16.51,83.223; 1.4 16.51,85.725; 1.6 19.05,85.725; 1.7 21.59,83.223; 1.8 21.59,85.725; 1.9 24.13,83.223; 1.10 24.13,85.725; 1.11 26.67,83.223; 1.12 26.67,85.725; 1.13 29.21,83.223; 1.14 29.21,85.725; 1.15 31.75,83.223; 1.16 31.75,85.725; 1.17 34.29,83.223; 1.18 34.29,85.725; 1.19 36.83,83.223; 1.20 36.83,85.725; 1.21 39.37,83.223; 1.22 39.37,85.725; 1.23 41.91,83.223; 1.24 41.91,85.725; 1.25 44.45,83.223; 1.26 44.45,85.725; 1.27 46.99,83.223; 1.28 46.99,85.725; 1.29 49.53,83.223; 1.30 49.53,85.725; 1.31 52.07,83.223; 1.32 52.07,85.725; 1.33 54.61,83.223; 1.34 54.61,85.725; 1.35 57.15,83.223; 1.36 57.15,85.725; 1.37 59.69,83.223; 1.38 59.69,85.725; 1.39 62.23,83.223; 1.40 62.23,85.725; 1.41 64.77,83.223; 1.42 64.77,85.725; 1.43 67.31,83.223; 1.44 67.31,85.725; 1.45 69.85,83.223; 1.46 69.85,85.725; 1.47 72.39,83.223; 1.48 72.39,85.725; 1.49 74.93,83.223; 1.50 74.93,85.725; 1.51 77.47,83.223; 1.52 77.47,85.725; 2.1 13.97,88.265; 2.2 13.97,90.805; 2.3 16.51,88.265; 2.4 16.51,90.805; 2.5 19.05,88.265; 2.6 19.05,90.805; 2.7 21.59,88.265; 2.8 21.59,90.805; 2.9 24.13,88.265; 2.10 24.13,90.805; 2.11 26.67,88.265; 2.12 26.67,90.805; 2.13 29.21,88.265; 2.14 29.21,90.805; 2.15 31.75,88.265; 2.16 31.75,90.805; 2.17 34.29,88.265; 2.18 34.29,90.805; 2.19 36.83,88.265; 2.20 36.83,90.805; 2.21 39.37,88.265; 2.22 39.37,90.805; 2.23 41.91,88.265; 2.24 41.91,90.805; 2.25 44.45,88.265; 2.26 44.45,90.805; 2.27 46.99,88.265; 2.28 46.99,90.805; 2.29 49.53,88.265; 2.30 49.53,90.805; 2.31 52.07,88.265; 2.32 52.07,90.805; 2.33 54.61,88.265; 2.34 54.61,90.805; 2.35 57.15,88.265; 2.36 57.15,90.805; 2.37 59.69,88.265; 2.38 59.69,90.805; 2.39 62.23,88.265; 2.40 62.23,90.805; 2.41 64.77,88.265; 2.42 64.77,90.805; 2.43 67.31,88.265; 2.44 67.31,90.805; 2.45 69.85,88.265; 2.46 69.85,90.805; 2.47 72.39,88.265; 2.48 72.39,90.805; 2.49 74.93,88.265; 2.50 74.93,90.805; 2.51 77.47,88.265; 2.52 77.47,90.805 | drill 1.016 pad 1.778: 1.5 19.05,83.223 | drill 3.175 pad 6.35: P$1 5.08,5.08; P$2 85.09,5.08; P$3 82.55,90.805; P$4 8.89,90.805
2MM_2PIN_HEADER = drill 0.8: 1 0,0; 2 2.007,0
USB-MICROB = smd 1.4 x 0.35: D+ -2.65,0; D- -2.65,-0.65; GND -2.65,1.3; ID -2.65,0.65; VBUS -2.65,-1.3 | smd 1.9 x 1.8: MT1 0,-4; MT2 0,4 | smd 1.9 x 1.9: P$1 0,-1.27; P$2 0,1.27
7443551600 = smd 5 x 4.5: P$1 3,2; P$2 3,12.5
XAL4040-103ME = smd 0.98 x 3.4: P$1 0.75,2; P$2 3.31,2
BSZ100N06LS3 = smd 0.635 x 0.254: P$1 0.127,0.66; P$2 0.127,1.321; P$3 0.127,2.007; P$4 0.127,2.642; P$5 3.175,2.642; P$6 3.175,1.981; P$7 3.175,1.321; P$8 3.175,0.66 | smd 1.702 x 2.261: P$9 2.032,1.651
0603-RES = smd 1.1 x 1: 1 -0.85,0; 2 0.85,0
ARDUINO_EVERY_NANO = smd 1.5 x 3: P$1 0.75,1.5; P$2 3.25,1.5; P$3 5.75,1.5; P$4 8.25,1.5; P$5 10.75,1.5; P$6 13.25,1.5; P$7 15.75,1.5; P$8 18.25,1.5; P$9 20.75,1.5; P$10 23.25,1.5; P$11 25.75,1.5; P$12 28.25,1.5; P$13 30.75,1.5; P$14 33.25,1.5; P$15 35.75,1.5; P$16 35.75,17.25; P$17 33.25,17.25; P$18 30.75,17.25; P$19 28.25,17.25; P$20 25.75,17.25; P$21 23.25,17.25; P$22 20.75,17.25; P$23 18.25,17.25; P$24 15.75,17.25; P$25 13.25,17.25; P$26 10.75,17.25; P$27 8.25,17.25; P$28 5.75,17.25; P$29 3.25,17.25; P$30 0.75,17.25
LT8390UFD = smd 0.8 x 0.3: P$1 0.3,4.5; P$2 0.3,4; P$3 0.3,3.5; P$4 0.3,3; P$5 0.3,2.5; P$6 0.3,2; P$7 0.3,1.5; P$8 0.3,1; P$15 4.2,1; P$16 4.2,1.5; P$17 4.2,2; P$18 4.2,2.5; P$19 4.2,3; P$20 4.2,3.5; P$21 4.2,4; P$22 4.2,4.5 | smd 0.3 x 0.8: P$9 1,0.3; P$10 1.5,0.3; P$11 2,0.3; P$12 2.5,0.3; P$13 3,0.3; P$14 3.5,0.3; P$23 3.5,5.2; P$24 3,5.2; P$25 2.5,5.2; P$26 2,5.2; P$27 1.5,5.2; P$28 1,5.2 | smd 2.6 x 3.6: P$29 2.25,2.75
LT8609S = smd 0.75 x 0.25: P$1 0.275,2.5; P$2 0.275,2; P$3 0.275,1.5; P$4 0.275,1; P$9 3.225,1; P$10 3.225,1.5; P$11 3.225,2; P$12 3.225,2.5 | smd 0.25 x 0.75: P$5 1,0.275; P$6 1.5,0.275; P$7 2,0.275; P$8 2.5,0.275; P$13 2.5,3.225; P$14 2,3.225; P$15 1.5,3.225; P$16 1,3.225 | smd 1.45 x 1.45: P$17 1.75,1.75 | smd 0.375 x 0.375: P$18 0.45,3.05; P$19 0.45,0.45; P$20 3.05,0.45; P$21 3.05,3.05

### Placement (x,y rotation side)
+3V3_SW1  81.82,24.67 90 top
+3V3_SW2  40.82,61.14 90 top
+3V3_SW3  56.77,42.69 90 top
+3V_BUS  82.12,81.71 90 top
+5V_BUS  82.02,63.19 90 top
+5V_SW1  10.28,64.65 270 top
+5V_SW2  33.5,72.3 90 top
+12V_SW1  81.72,43.73 90 top
C1  29.02,12.54 90 top
C2  26.72,12.56 90 top
C3  10.82,23.78 90 top
C4  12.42,12.5 90 top
C5  22.08,21.28 270 top
C6  24.43,21.28 270 top
C7  19.77,29.29 90 top
C8  19.82,16.36 90 top
C9  22.12,34.18 90 top
C10  10.83,29.3 270 top
C11  19.77,34.22 90 top
C12  22.07,39.24 90 top
C13  66.53,46.29 270 top
C15  22.12,12.55 90 top
C16  19.82,12.52 90 top
C17  19.77,39.24 90 top
C18  69.32,36.66 90 top
C19  66.28,32.32 270 top
C20  75.48,31 270 top
C21  75.37,36.57 90 top
C22  81.62,36.49 90 top
C23  69.37,55.76 90 top
C24  66.23,51.32 270 top
C25  75.73,51.4 270 top
C26  75.77,55.72 90 top
C27  81.97,55.74 90 top
C28  22.43,71.64 270 top
C29  25.57,76.08 90 top
C30  16.42,77.1 90 top
C31  16.53,71.48 270 top
C32  10.21,71.5 270 top
C33  69.89,74.42 90 top
C34  66.81,70.16 270 top
C35  76.01,70.14 270 top
C36  76.09,74.38 90 top
C37  82.19,74.4 90 top
C38  69.79,17.52 90 top
C39  66.81,13.36 270 top
C40  76.41,12.19 270 top
C41  75.79,17.68 90 top
C42  81.89,17.6 90 top
C44  73.08,46.39 270 top
C45  71.08,61.44 90 top
C46  67.83,61.39 90 top
C47  28.38,71.59 270 top
C48  21.31,65.69 90 top
C49  18.26,61.25 270 top
C50  28.11,60.4 270 top
C51  27.41,65.56 90 top
C52  33.5,65.44 90 top
C53  28.63,54.54 90 top
C54  25.58,50.1 270 top
C55  35.17,50.1 270 top
C56  34.77,54.61 90 top
C57  40.82,54.29 90 top
C58  44.58,36.09 90 top
C59  41.53,31.64 270 top
C60  51.42,31.04 270 top
C61  50.67,35.96 90 top
C62  56.77,35.84 90 top
C63  28.38,76.09 270 top
C64  61.48,77.59 90 top
C65  64.43,77.54 90 top
C66  61.38,65.29 180 top
C67  61.38,62.39 180 top
C68  31.33,75.94 0 top
C69  31.33,78.99 0 top
C70  37.93,71.79 0 top
C71  37.88,74.79 0 top
C72  46.38,65.29 0 top
C73  46.33,62.34 0 top
C74  14.28,38.49 270 bottom
C75  10.38,38.49 270 bottom
C76  10.43,44.49 90 bottom
C77  14.33,44.44 90 bottom
C78  18.23,50.44 90 bottom
C79  14.38,50.49 90 bottom
C80  10.43,50.54 90 bottom
C81  10.38,57.19 90 bottom
D1  7.1,79.38 90 bottom
D2  60.73,9.44 0 top
D3  85.67,15.88 90 bottom
D4  26.85,39.24 270 top
H1  0,0 0 top
J2  4.33,78.31 90 top
J3  4.57,16.14 270 top
J4  78.4,1.75 180 top
J5  88.43,14.26 90 top
J6  63.68,3.04 270 top
J12  31.31,1.77 0 top
J14  88.37,51.49 270 top
J16  88.39,68.98 90 top
L1  8.47,36.49 0 top
L2  82.61,30.24 90 top
L3  81.21,49.4 90 top
L4  9.29,78.12 270 top
L5  81.51,68.16 90 top
L6  82.81,11.42 90 top
L7  34.39,59.21 90 top
L8  41.71,48.06 90 top
L9  57.66,29.61 90 top
L10  28.78,13.54 270 bottom
M1  14.31,13.53 270 top
M2  9.91,21.11 270 top
M3  9.93,32.61 0 top
M4  14.31,32.61 0 top
R1  24.41,12.53 270 top
R2  24.41,16.41 270 top
R3  17.51,29.29 270 top
R4  15.21,29.27 270 top
R5  22.11,16.4 270 top
R6  8.46,23.78 270 top
R7  24.44,34.19 90 top
R8  22.09,29.26 90 top
R9  26.81,29.22 270 top
R10  66.26,36.7 270 top
R11  72.31,36.63 270 top
R12  78.39,36.6 270 top
R13  78.41,40.77 90 top
R14  66.29,55.76 270 top
R15  72.49,55.74 270 top
R16  78.89,55.72 270 top
R17  78.91,60.1 90 top
R18  25.51,71.62 90 top
R19  19.41,71.54 90 top
R20  13.31,71.46 90 top
R21  13.29,67.52 270 top
R22  66.89,74.4 270 top
R23  72.89,74.38 270 top
R24  79.19,74.46 270 top
R25  79.21,78.66 90 top
R26  66.79,17.52 270 top
R27  72.79,17.7 270 top
R28  78.89,17.68 270 top
R29  78.91,21.74 90 top
R30  45.62,54.92 90 bottom
R31  43.4,54.95 90 bottom
R32  24.43,29.24 90 top
R33  4.48,10.74 270 bottom
R34  7.93,14.34 0 bottom
R35  7.93,11.39 0 bottom
R36  78.93,5.04 90 bottom
R37  18.26,65.69 270 top
R38  24.23,65.56 270 top
R39  30.46,65.44 270 top
R40  30.46,69.5 90 top
R41  33.5,69.37 90 top
R42  25.58,54.54 270 top
R43  31.55,54.61 270 top
R44  75.34,40.79 270 top
R45  72.29,40.82 270 top
R46  29.31,34.1 90 top
R47  29.39,39.28 270 top
R48  81.93,21.7 90 top
R49  82.23,78.62 90 top
R50  82.03,60.04 90 top
R51  10.17,67.54 270 top
R52  81.63,40.68 90 top
R53  37.77,54.29 270 top
R54  37.77,58.35 90 top
R55  40.82,58.22 90 top
R56  41.53,36.09 270 top
R57  47.5,35.96 270 top
R58  53.72,35.84 270 top
R59  53.72,39.9 90 top
R60  56.77,39.77 90 top
R61  73.03,2.34 0 bottom
R62  75.83,5.04 90 bottom
R66  8.87,85.06 270 top
U1  36.83,6.35 90 bottom
U2  18.91,21.99 90 top
U3  69.74,30.39 0 top
U4  69.96,49.59 0 top
U5  22.22,77.81 180 top
U6  70.23,68.31 0 top
U7  70.25,11.51 0 top
U8  21.82,59.47 0 top
U9  29.13,48.32 0 top
U10  45.08,29.87 0 top

### Tracks (layer width: path | path; a pad name or v marks a point on that pad's centre or on a via)
+3V3_BUS  (via drill 0.35)
  Top 0.254: R25.1 82.19,77.76 R49.1 82.23,75.34 | 82.23,75.34 C37.2 79.25,75.3 R24.1 79.11,75.28 C36.2 75.12,75.28 73.76,76.64 C65.1 64.38,76.69 C64.1 61.4,76.6 59,76.6 54,81.6 46.7,81.6 45.75,82.55 45.75,86.24 47,87.5 H1.2.27 | L5.P$2 80.7,72.66 80.7,73.9 82.14,75.34 82.23,75.34
  Top 0.406: H1.1.48 72.39,84.98 73.65,83.72 73.65,82.15 74.2,81.6 79.5,81.6 80.8,80.3 80.8,79.1 82.14,77.76 82.19,77.76 | H1.2.27 | C37.2 v84.1,75.3
  Bottom 0.254: U1.P$11 41.1,32.1 41.5,32.5 41.5,56.62 | 41.5,56.62 41.5,77.6 45.75,81.84 45.75,86.24 46.99,87.48 H1.2.27 H1.2.28 | R30.2 45.6,55.85 R31.2 42.27,55.85 41.5,56.62
+3V3_BUS_PGOOD  (via drill 0.35)
  Top 0.254: U6.P$12 74.11,70.81 74.4,71.1 v74.4,72.1 | v74.8,76.7 76.8,76.7 77.1,77 77.1,79 77.66,79.56 R25.2
  Bottom 0.254: v74.4,72.1 74.4,76.3 v74.8,76.7
+3V3_SW1  (via drill 0.35)
  Top 0.254: 81.93,18.6 R48.1 81.89,20.84 R29.1 77.76,20.84 77.3,21.3 77.3,28 76.8,28.5 63.4,28.5 62.28,29.62 C67.1 C66.1 62.3,65.3 62.3,67.6 52.5,77.4 42.9,77.4 38.1,82.2 38.1,86.99 H1.2.19 | 81.93,18.6 81.93,18.54 C42.2 81.81,18.58 R28.1 C41.2 | L6.P$2 80.81,17.48 81.93,18.6
  Top 0.406: C42.2 81.99,18.6 v83.8,18.6
+3V3_SW1_EN  (via drill 0.35)
  Top 0.254: v77.9,14.7 77.9,14.5 77.48,14.09 75.53,14.09 74.95,13.51 U7.P$11
  Bottom 0.254: U1.P$21 71.8,29.6 72.3,29.1 72.3,14.7 72.8,14.2 76.59,14.2 77.09,14.7 v77.9,14.7
+3V3_SW2
  Top 0.19: 35.1,55.19 C56.2 | 37.9,57.32 R54.1
  Top 0.254: L8.P$2 39.71,54.08 C57.2 | C57.2 R53.1 35.1,55.19 | C57.2 R55.1 37.9,57.32 | R54.1 36.82,57.45 36.68,57.59 36.68,71.44 C70.1 36.98,71.84 36.98,74.54 C71.1 36.98,76.59 32.98,80.59 32.98,89.5 H1.2.18
+3V3_SW2_EN  (via drill 0.35)
  Top 0.254: U9.P$11 33.16,50.32 33.48,50.64 v33.48,51.74 | v46.43,10.84 34.28,10.84 33.08,12.04 33.08,15.64 31.08,17.64 v31.08,29.89
  Bottom 0.254: U1.P$30 52.27,7.1 51.58,7.79 51.58,10.44 51.23,10.79 46.48,10.79 v46.43,10.84 | v31.08,29.89 31.08,51.89 31.48,52.29 33.08,52.29 33.48,51.89 v33.48,51.74
+3V3_SW2_PGOOD
  Top 0.254: R54.2 38.78,58.24 43.13,58.24 43.38,57.99 43.38,50.69 43.13,50.44 37.18,50.44 36.68,50.94 36.68,52.24 36.38,52.54 32.88,52.54 32.68,52.34 32.68,50.98 32.52,50.82 U9.P$12
+3V3_SW3
  Top 0.19: 50.8,36.74 C61.2 | 53.85,38.87 R59.1
  Top 0.254: L9.P$2 55.66,35.62 C62.2 | C62.2 R58.1 50.8,36.74 | C62.2 R60.1 53.85,38.87 | H1.2.20 35.53,89.51 35.53,80.59 40.28,75.84 40.28,73.19 45.48,67.99 C72.1 45.48,62.39 | R59.1 49.07,39 46.93,41.14 46.93,43.79 45.48,45.24 45.48,62.39 | 45.48,62.39 C73.1
+3V3_SW3_EN  (via drill 0.35)
  Top 0.254: U10.P$11 49.26,31.87 49.48,32.09 v49.48,32.14
  Bottom 0.254: U1.P$24 51.5,22.1 48.78,24.82 48.78,31.94 48.98,32.14 v49.48,32.14
+3V3_SW3_PGOOD
  Top 0.19: 48.51,32.37 U10.P$12
  Top 0.254: R59.2 54.53,39.99 58.78,39.99 59.08,39.69 59.08,32.29 58.78,31.99 53.13,31.99 52.63,32.49 52.63,32.84 52.43,33.04 49.18,33.04 48.51,32.37
+5V_BUS  (via drill 0.35)  (1 unrouted)
  Top 0.254: L3.P$2 80.4,53.9 80.4,55.07 C27.2 | C27.2 78.91,56.64 R16.1 C26.2 | C27.2 81.97,59.08 R50.1 78.97,59.14 R17.1
  Top 0.305: H1.2.25 43.2,87.02 43.2,82 45,80.2 53.4,80.2 64.85,68.75 64.85,60.9 65.3,60.45 67.79,60.45 | C46.1 71.03,60.49 | C45.1 71.85,60.54 C26.2
  Top 0.406: C27.2 83.84,56.64 | 67.79,60.45 C46.1 | 71.03,60.49 C45.1
  Bottom 0.305: 38.23,42 34,42 33,41 33,31 34.4,29.6 U1.P$10 | H1.2.26 H1.2.25 43.2,87.02 43.2,81.8 39.7,78.3 39.7,43.47 U1.P$15
  Bottom 0.406: U1.P$15 38.23,42
  other vias: 83.8,56.6
+5V_BUS_PGOOD  (via drill 0.35)
  Top 0.254: U4.P$12 73.89,52.09 74.1,52.3 v74.1,52.6 | v83.9,60 79.91,60 R17.2
  Bottom 0.254: v74.1,52.6 74.6,53.1 84.6,53.1 85,53.5 85,59.6 84.6,60 v83.9,60
+5V_SW1  (via drill 0.35)
  Top 0.19: C32.2 10.21,70.5 10.11,70.6 | 10.21,68.48 R51.1 | 13.27,70.6 R20.1 13.33,70.58 | 13.31,68.44 R21.1
  Top 0.305: L4.P$2 11.29,71.68 C32.2 13.27,70.6 | 10.21,70.5 10.21,68.48 | R20.1 13.31,68.44 | 13.33,70.58 C31.2 16.53,69.67 17,69.2 26.2,69.2 27.03,70.04 27.03,71.54 | v8.2,70.6 10.11,70.6 | H1.2.13 27.93,86.98 27.93,79.23 27.03,78.34 27.03,75.64 | 27.03,71.54 27.98,72.49 C47.1 | 27.03,71.54 27.03,75.64 | 27.03,75.64 C63.1
+5V_SW1_EN  (via drill 0.35)
  Top 0.254: U5.P$11 18.41,75.81 17.75,75.15 16.5,75.15 v15.4,74.05 | v14.8,65.8 14.8,56.1 16.1,54.8 19.5,54.8 21.6,52.7 21.6,45.7 22.4,44.9 33.1,44.9 37.4,40.6 37.4,16.9 38,16.3 55.7,16.3 57.1,17.7 v57.1,24.2
  Bottom 0.254: v15.4,74.05 15.42,74.02 14.8,73.4 v14.8,65.8 | v57.1,24.2 57.1,26.6 56.6,27.1 U1.P$22
+5V_SW2
  Top 0.19: 27.53,66.34 C51.2 | R41.1 30.58,68.47 R40.1
  Top 0.254: L7.P$2 32.39,65.23 C52.2 | C52.2 R39.1 27.53,66.34 | R41.1 C52.2 | R40.1 29.83,68.6 29.54,68.89 29.54,71.61 30.51,72.57 | 30.51,89.56 H1.2.16
  Top 0.305: 30.51,72.57 30.51,75.86 C68.1 C69.1 30.45,79.01 30.45,89.51 30.51,89.56
+5V_SW2_EN  (via drill 0.35)
  Top 0.254: v32.98,9.69 31.08,11.59 31.08,14.19 28.88,16.39 v28.88,29.89 | v26.23,61.49 26.21,61.47 U8.P$11
  Bottom 0.254: U1.P$1 35.57,7.1 v32.98,9.69 | v28.88,29.89 28.73,30.04 28.73,60.74 27.98,61.49 v26.23,61.49
+5V_SW2_PGOOD  (1 unrouted)
  Top 0.254: R40.2 31.45,69.41 35.69,69.41 35.92,69.19 35.92,61.84 35.67,61.59 29.62,61.59 29.37,61.84 29.37,62.19 29.17,62.39 25.65,62.39 25.23,61.97
+12V_SW1  (via drill 0.35)
  Top 0.254: L2.P$2 80.61,36.38 C22.2 | C22.2 81.62,39.77 R52.1 78.5,39.78 R13.1 75.36,39.87 R44.2 | C22.2 78.5,37.39 R12.1 75.4,37.5 C21.2
  Top 0.406: H1.2.24 H1.2.23 41.91,87.48 40.66,86.24 40.66,82.06 43.83,78.9 52.8,78.9 63.55,68.15 63.55,49.05 64.91,47.69 C13.1 66.93,47.29 C44.1 78.81,47.29 80,46.1 80,41 81.23,39.77 81.62,39.77 | C22.2 81.73,37.5 v83.7,37.5
+12V_SW1_EN  (via drill 0.35)
  Top 0.254: U3.P$11 73.99,32.39 74.59,32.99 75.84,32.99 v76.3,33.45
  Bottom 0.254: v76.3,33.45 76.62,33.45 76.98,33.09 76.98,32.44 76.64,32.1 U1.P$20
BATT_HTR_EN
  Bottom 0.254: U1.P$25 51.3,19.6 47.2,23.7 47.2,43.3 50.3,46.4 60.1,46.4 75.9,62.2 75.9,76.67 69.85,82.72
  Bottom 0.406: 69.85,82.72 H1.1.45
BATT_HTR_FAULT
  Bottom 0.254: U1.P$26 45.45,17.1 40.7,12.35 40.7,6.1 40.1,5.5 35.8,5.5 31.7,9.6 31.7,20.3 23.3,28.7 23.3,76.4 19.7,80 17.9,80 16.51,81.39 H1.1.3
BATT_HTR_PGOOD
  Bottom 0.254: U1.P$27 44.7,14.6 41.8,11.7 41.8,5.9 40.5,4.6 35.3,4.6 30.7,9.2 30.7,19.4 22.2,27.9 22.2,75.9 19.5,78.6 16.2,78.6 13.97,80.83 H1.1.1
BATT_TEMP
  Bottom 0.254: H1.2.1 15.22,89.51 24.59,89.51 25.45,88.65 25.45,30.95 34.3,22.1 U1.P$7
EPS_RESET
  Bottom 0.254: U1.P$18 57.3,37.1 81.05,60.85 81.05,82.14 H1.1.52
EPS_RX
  Bottom 0.254: U1.P$17 58.5,39.6 79.62,60.72 79.62,81.07 H1.1.51
EPS_TX
  Bottom 0.254: U1.P$16 59.4,42.1 78.23,60.93 78.23,79.92 H1.1.49
EPS_VOLT
  Bottom 0.254: U1.P$6 35.1,19.6 24.38,30.32 24.38,76.99 19.67,81.7 18.2,81.7 17.8,82.1 17.8,86.97 H1.2.3
EPS_XALERT
  Bottom 0.254: U1.P$23 51.5,24.6 50.5,25.6 50.5,42.3 52,43.8 59.31,43.8 77.05,61.54 77.05,78.4 73.68,81.77 73.68,84.48 H1.1.50
GND  (via drill 0.35, 0.6)
  Top 0.19: M2.P$2 M2.P$3 M2.P$4 | M3.P$4 M3.P$3 M3.P$2
  Top 0.254: U8.P$14 23.82,61.47 U8.P$17 23.69,61.1 | 23.69,61.1 23.82,60.97 U8.P$7 U8.P$8 24.49,59.92 U8.P$20 | 23.69,61.1 23.56,60.97 U8.P$3 U8.P$4 22.09,60.09 U8.P$19 | U5.P$14 20.22,75.81 U5.P$17 | U5.P$17 | U5.P$20 19.55,77.36 U5.P$8 U5.P$7 20.22,76.39 | 20.22,76.39 20.22,76.3 U5.P$17 | 20.22,76.39 20.3,76.31 U5.P$3 U5.P$4 21.95,77.19 U5.P$19 | 31.05,49.9 31.13,49.82 U9.P$7 U9.P$8 31.81,48.77 U9.P$20 | 31.05,49.9 30.92,50.03 | 30.92,50.03 U9.P$17 | 31.05,49.9 30.96,49.82 U9.P$3 U9.P$4 29.41,48.94 U9.P$19 | U2.P$7 17.41,23.31 16.48,24.24 U2.P$29 15.91,24.49 U2.P$19 | U7.P$14 72.25,13.51 U7.P$17 | U7.P$19 70.52,12.13 U7.P$4 U7.P$3 71.75,13.01 U7.P$17 | U7.P$20 73.12,11.79 U7.P$8 U7.P$7 72.25,13.01 U7.P$17 | U3.P$20 72.61,30.67 U3.P$8 U3.P$7 71.74,31.89 U3.P$17 | U3.P$19 70.02,31.01 U3.P$4 U3.P$3 71.24,31.89 U3.P$17 | U3.P$14 71.74,32.39 U3.P$17 | U4.P$20 72.83,49.87 U4.P$8 U4.P$7 71.96,51.01 71.67,51.3 | U4.P$19 70.23,50.22 U4.P$4 U4.P$3 71.46,51.09 71.67,51.3 | 71.67,51.3 U4.P$17 71.96,51.59 U4.P$14 | U6.P$20 73.1,68.58 U6.P$8 U6.P$7 72.23,69.81 U6.P$17 | U6.P$19 70.5,68.94 U6.P$4 U6.P$3 71.73,69.81 U6.P$17 | U6.P$14 72.23,70.31 U6.P$17 | U10.P$20 47.96,30.14 U10.P$8 | U10.P$7 47.08,31.37 47,31.45 | 47,31.45 U10.P$17 47.08,31.87 U10.P$14 | U10.P$4 45.36,30.49 U10.P$19 | U10.P$3 46.91,31.37 47,31.45 | U9.P$14 31.13,50.24 30.92,50.03
  other vias: 5,74.5 5,73 5,71.6 5,70 5,68.5 5,67.1 5,65.4 5,63.9 5,62.5 5,60.9 5,59.4 5,58 5,56.4 5,54.9 5,53.5 5,35.4 5,33.8 5,32.3 5,30.9 5,29.2 5,27.7 5,26.3 5,24.7 5,23.2 5,21.8 5,20.2 5,18.8 17.6,81.3 19,80.8 12.6,32 12.6,30.7 42.95,6.05 49.7,6 88,64.3 88,62.7 88,61.2 88,59.6 88,58 88,56.5 88,54.9 86.8,50.3 86.4,49 20.7,24.2 88,38 88,36.4 88,34.9 88,33.5 88,31.9 88,30.4 88,29 88,27.3 88,25.8 88,24.4 88,22.8 88,21.3 88,19.9 10.8,2.6 12.4,2.6 13.9,2.6 15.5,2.6 17.1,2.6 18.6,2.6 20.2,2.6 16.8,14.5 85.4,70.75 29.28,80.69 57.33,5.94 17.28,32.19 36.83,48.79 29.73,59.89 35.08,65.49 16.08,63.09 18.28,58.19 9.98,80.14 12.03,80.14 8.18,73.34 14.23,74.69 23.58,80.59 26.68,80.64 31.58,73.19 35.78,56.84 42.53,52.19 42.48,43.14 44.58,43.14 49.08,43.14 64.28,40.44 67.83,40.44 81.63,47.99 82.53,67.29 78.13,11.54 74.23,9.14 77.63,9.04 14.43,31.64 8.83,34.59 27.03,20.34 27.03,16.89 19.23,19.84 8.98,19.44 12.23,16.14 27.08,56.34 14.28,77.54 8.18,43.24 16.38,43.19 10.68,13.39 18.13,36.54 84.08,73.24 80.33,84.94 85.23,85.04 59.38,78.99 66.58,78.89 63.43,74.34 68.33,65.34 86.58,10.09 77.33,30.74 78.88,26.19 34.28,80.69 36.88,80.69 44.13,70.74 46.63,75.84 19.83,68.09 15.83,80.59 15.63,27.29 66.33,58.94 69.43,58.89 66.83,20.49 59.58,21.99 60.43,48.14 69.78,20.54 75.03,26.24 75.48,21.44 77.73,33.84 70.58,45.09 75.08,44.94 58.28,35.84 44.58,21.19 49.08,33.79 18.23,73.94 15.68,68.09 26.23,63.24 73.48,34.29 74.28,15.19 17.88,76.39 70.18,2.29
  pour Top: 92.5,-5.3 92.5,98.2 -4.8,98.2 -4.8,-5.3
  pour Bottom: -5.8,98.9 -5.8,-6.2 93.2,-6.2 93.2,98.9
I2C_SCL
  Bottom 0.19: 47.1,57.7 47.12,57.68
  Bottom 0.254: U1.P$9 41.2,27.1 43.4,29.3 R31.1 44.27,54.92 46.64,54.92 47.12,55.41 47.12,57.68 | H1.1.43 66.06,84.47 64.25,84.47 63.52,83.74 63.52,82.36 62.57,81.4 47,81.4 43.2,77.6 43.2,58.7 43.77,58.13 46.68,58.13 47.1,57.7
I2C_SDA
  Bottom 0.254: U1.P$8 41.4,24.6 45.62,28.82 45.62,53.98 | H1.1.41 64.77,81.67 63.5,80.4 47.6,80.4 45.05,77.85 45.05,59.7 47.61,59.7 48.1,59.21 48.1,54.46 47.63,53.98 45.62,53.98 | 45.62,53.98 R30.1
N$1
  Top 0.19: M2.P$8 M2.P$7 M2.P$6 | M2.P$6 M2.P$5 | M2.P$6 11.89,18.75 M2.P$9 | M1.P$2 M1.P$3 M1.P$4
  Top 0.254: U2.P$2 14.91,14.79 15.63,14.07 M1.P$2 15.63,13.03 15.4,12.8 14.4,12.8 13.9,13.3 13.9,18.7 | U2.P$28 13.9,22.8 13.9,18.7 | C3.1 11.02,22.88 11.13,22.99 | M2.P$9 13.52,19.08 13.9,18.7
  Top 0.305: U2.P$28 11.13,22.99
  Top 0.406: C3.1 R6.2
N$2
  Top 0.254: U2.P$27 12.01,23.49 C3.2
N$4
  Top 0.254: U3.P$5 70.74,29.86 71.4,29.2 72,29.2 | 72,29.2 80.35,29.2 80.61,29.46 L2.P$1 | U3.P$6 71.24,29.96 72,29.2
N$6
  Top 0.254: U3.P$1 69.31,32.89 67.8,34.4 67.8,35.4 67.4,35.8 R10.2
N$7
  Top 0.254: U3.P$13 72.24,35.66 R11.2 75.31,35.73 C21.1 78.36,35.67 R12.2
N$8
  Top 0.254: U4.P$1 69.31,52.09 67.8,53.6 67.8,54.5 67.4,54.9 66.33,54.9 R14.2
N$9
  Top 0.254: C19.1 67.18,33.22 68.01,32.39 U3.P$2
N$10
  Top 0.254: U3.P$15 71.24,34.26 70.9,34.6 70.9,35.3 70.44,35.76 C18.1
N$11
  Top 0.254: U4.P$13 72.46,54.81 R15.2 75.75,54.84 C26.1 R16.2
N$12
  Top 0.254: U4.P$2 67.91,51.59 67.28,52.22 C24.1
N$13
  Top 0.254: U4.P$15 71.46,53.34 71,53.8 71,54.4 70.5,54.9 69.41,54.9 C23.1
N$14
  Top 0.254: U4.P$5 70.96,48.94 71.7,48.2 72.4,48.2 | L3.P$1 77.26,48.2 72.4,48.2 | U4.P$6 71.46,49.14 72.4,48.2
N$15
  Top 0.406: 22.45,28.36 24.23,30.14
  Top 0.61: R8.1 22.45,28.36 | 24.23,30.14 R32.2
N$16
  Top 0.254: U5.P$1 22.49,75.31 24,73.8 24,73.2 24.68,72.52 R18.2
N$17
  Top 0.254: U2.P$26 12.41,23.99 12,24.4 12,25.7 11.85,25.85 9.85,25.85 9.65,25.65 9.65,24 9.45,23.8 7.5,23.8 7.3,23.6 7.3,21.2 7.52,20.98 M2.P$1
N$18
  Top 0.254: R20.2 16.51,72.36 C31.1 19.35,72.38 R19.2 19.17,72.68 19.37,72.68 19.37,73.57 19.72,73.92 U5.P$13
N$19
  Top 0.254: U5.P$2 23.89,75.81 24.52,75.18 C29.1
N$20
  Top 0.254: U5.P$15 20.72,73.88 20.9,73.7 20.9,73.2 21.56,72.54 C28.1
N$21
  Top 0.254: L4.P$1 12.82,78.9 19.9,78.9 | U5.P$5 21.22,78.28 20.6,78.9 19.9,78.9 | U5.P$6 20.72,78.08 19.9,78.9
N$23
  Top 0.254: U6.P$1 69.99,70.81 68.4,72.4 68.4,73 67.9,73.5 R22.2
N$24
  Top 0.254: R24.2 76.17,73.56 C36.1 R23.2 72.73,73.32 U6.P$13
N$25
  Top 0.254: U6.P$2 68.49,70.31 67.74,71.06 C34.1
N$26
  Top 0.254: U6.P$15 71.73,72.27 71.4,72.6 71.4,73 70.88,73.52 C33.1
N$27
  Top 0.254: U6.P$5 71.23,67.87 71.8,67.3 72.5,67.3 | L5.P$1 77.9,67.3 72.5,67.3 | U6.P$6 71.73,68.07 72.5,67.3
N$29
  Top 0.254: U7.P$1 69.89,14.01 68.3,15.6 68.3,16.1 67.78,16.62 R26.2
N$30
  Top 0.254: R28.2 C41.1 72.81,16.78 R27.2 72.79,14.77 U7.P$13
N$31
  Top 0.254: U7.P$2 68.49,13.51 67.74,14.26 C39.1
N$32
  Top 0.254: U7.P$15 71.75,15.35 71.4,15.7 71.4,16 70.78,16.62 C38.1
N$33
  Top 0.254: U7.P$5 71.25,11.05 71.9,10.4 72.6,10.4 | 72.6,10.4 80.59,10.4 80.81,10.62 L6.P$1 | U7.P$6 71.75,11.25 72.6,10.4
N$34
  Top 0.254: U2.P$1 14.41,13.96 M1.P$1
N$35
  Top 0.254: U2.P$25 12.81,24.49 12.5,24.8 12.5,25.9 12.1,26.3 10.3,26.3 9.6,27 9.6,32 10.06,32.46 M3.P$1
N$36
  Top 0.254: R1.1 R2.2 23.52,16.4 18.2,16.4 16.91,17.69 U2.P$6
N$39
  Top 0.254: U2.P$8 U2.P$9 | U2.P$10 U2.P$9 | U2.P$9 21.27,22.99 C5.1
N$40
  Top 0.254: C6.1 24.43,23.03 21.27,26.19 U2.P$15
N$41
  Top 0.254: U2.P$17 16.91,26.71 17.48,27.28 18.66,27.28 C7.1
  Top 0.406: C7.1 R3.2
N$42
  Top 0.254: U2.P$18 16.4,26.2 16.4,28.1 16.13,28.37 R4.2
N$43
  Top 0.254: R5.1 22.11,18.21 23.25,19.35 23.25,23.25 21.01,25.49 U2.P$14
N$44
  Top 0.254: R5.2 19.86,15.5 | 19.86,15.5 C8.1 | U2.P$5 16.41,17.61 18.52,15.5 19.86,15.5
N$45  (via drill 0.35)
  Top 0.254: 10.62,38.49 L1.P$1 11.46,38.5 v8.1,38.5 | v15.7,16.4 15.41,16.69 U2.P$3
  Top 0.406: R6.1 7.91,25.23 7.91,35.78 10.62,38.49
  Bottom 0.254: v15.7,16.4 16.2,15.9 16.2,15.3 15.7,14.8 11.3,14.8 7.6,18.5 7.6,38 v8.1,38.5
N$46
  Top 0.19: M3.P$8 M3.P$7 M3.P$6 | M3.P$6 M3.P$5 | M3.P$6 12.45,34.59 11.96,34.1 | M4.P$4 M4.P$3 M4.P$2
  Top 0.254: U2.P$23 13.7,25.5 | M3.P$9 11.96,34.1 | 10.8,30.23 C10.1 | M3.P$5 M4.P$4 | M4.P$2 M3.P$7 | M3.P$6 14.41,34.59 M4.P$3
  Top 0.305: 13.7,25.5 13.7,26.1 12.1,27.7 12.1,29.7 11.6,30.2 C10.1
  Top 0.406: 11.96,34.1 11.96,32.96 10.8,31.8 10.8,30.23 | M3.P$9 11.96,35.46 12.3,35.8 14.2,35.8 14.7,36.3 14.7,45.76 L1.P$2
N$47
  Top 0.254: U2.P$24 13.21,24.99 13,25.2 13,26.1 12.3,26.8 11.1,26.8 10.83,27.07 C10.2
N$48  (via drill 0.35)
  Top 0.19: M4.P$5 M4.P$6 | M4.P$6 M4.P$7 M4.P$8 | M4.P$6 16.67,34.59 M4.P$9
  Top 0.254: U2.P$21 14.9,26.2 | R7.1 | 16.34,31.16 16.35,31.15 | M4.P$9 16.34,34.4 15.5,34.4 15.2,34.1 15.2,32.7 v15.4,32.5 | U2.P$11 19.51,23.99 v19.8,23.7
  Top 0.305: 16.35,31.15 16.35,29.45 16.1,29.2 14.35,29.2 14.1,28.95 14.1,27.4 14.3,27.2 14.6,27.2 14.9,26.9 14.9,26.2 | M4.P$9 16.34,31.16 | R7.1 23.28,34.45 23.28,37.94 22.88,38.34 C12.1 | 16.34,38.48 v16.33,38.49
  Top 0.406: C9.1 R7.1 | M4.P$9 16.34,36.65 | 16.34,36.65 18.03,38.34 C17.1 C12.1 | 16.34,36.65 16.34,38.48
  Bottom 0.254: v19.8,23.7 19.8,23.1 19.5,22.8 15.7,22.8 14.43,24.07 14.43,30.24 15.73,31.54 15.73,32.17 v15.4,32.5
  Bottom 0.305: 14.28,42.99 C77.1 | 10.48,43.04 C76.1
  Bottom 0.406: v16.33,38.49 16.33,39.34 15.78,39.89 C74.1 | C74.1 C75.1 | C74.1 14.28,42.99 | C77.1 10.48,43.04
N$49
  Top 0.254: U2.P$22 13.6,27 13.6,32 14.44,32.84 M4.P$1
N$50  (via drill 0.35)
  Top 0.813: J12.1 31.31,6.91 v30.23,7.99
  Bottom 0.813: v30.23,7.99 27.68,10.54 L10.P$1
N$51
  Top 0.254: U2.P$16 17.41,26.64 17.64,26.87 22.96,26.87 R32.1
  Top 0.406: R32.1 26.79,28.34
  Top 0.61: 26.79,28.34 R9.2
N$52
  Bottom 0.406: J3.1 6.5,18.07 6.5,76.14 | 6.5,76.14 J2.1 | 6.5,76.14 6.5,76.3 7.1,76.9 D1.C
  Bottom 0.61: R34.2 7.08,15.34 6.28,16.14 J3.1
N$53
  Bottom 0.61: J3.2 4.57,11.68 R33.1 4.68,11.39 R35.2
N$54
  Top 0.254: R48.2 81.93,24.56 +3V3_SW1.1
N$55
  Top 0.254: R3.1 17.52,30.2
  Top 0.406: 17.52,30.2 18.4,30.2 18.65,30.45 18.65,31.95 18.9,32.2 19.55,32.2 19.77,32.42 C11.1
N$56
  Top 0.254: R52.2 81.63,43.64 +12V_SW1.1
N$57
  Bottom 0.406: 75.81,2.34 75.83,2.32
  Bottom 0.61: J4.2 75.83,2.32 R62.1 | R61.1 75.81,2.34
N$58
  Top 0.406: J6.VBUS 62.38,9.42 D2.A
N$59
  Top 0.254: U8.P$1 21.09,61.97 R37.2
N$60
  Top 0.254: R50.2 +5V_BUS.1
N$61
  Top 0.19: 24.32,64.58 R38.2 | C51.1 27.53,64.54
  Top 0.254: U8.P$13 24.32,64.58 | 27.53,64.54 R39.2 | R38.2 C51.1
N$62
  Top 0.254: U8.P$2 18.94,61.47 C49.1
N$63
  Top 0.19: 21.66,64.79 C48.1
  Top 0.254: U8.P$15 23.32,63.13 21.66,64.79
N$64
  Top 0.254: U8.P$5 22.82,59.13 23.37,58.59 23.87,58.59 | L7.P$1 31.02,58.59 23.87,58.59 | U8.P$6 23.32,59.13 23.87,58.59
N$65
  Top 0.254: +5V_SW2.1 R41.2
N$66
  Top 0.254: U9.P$1 28.4,50.82 R42.2
N$67
  Top 0.19: 31.63,53.63 R43.2 | C56.1 34.8,53.69
  Top 0.254: U9.P$13 31.63,53.63 | 34.8,53.69 37.47,53.69 R53.2 | C56.1 R43.2
N$68
  Top 0.254: U9.P$2 26.26,50.32 C54.1
N$69
  Top 0.19: 28.98,53.64 C53.1
  Top 0.254: U9.P$15 30.63,51.98 28.98,53.64
N$70
  Top 0.254: U9.P$5 30.13,47.98 30.68,47.44 31.18,47.44 | L8.P$1 38.33,47.44 31.18,47.44 | U9.P$6 30.63,47.98 31.18,47.44
N$71
  Top 0.254: +3V3_SW2.1 R55.2
N$72
  Top 0.254: U10.P$1 44.35,32.37 R56.2
N$73
  Top 0.19: 47.58,34.98 R57.2 | C61.1 50.8,34.94
  Top 0.254: U10.P$13 47.58,34.98 | 50.8,34.94 R58.2 | R57.2 C61.1
N$74
  Top 0.254: U10.P$2 42.21,31.87 C59.1
N$75
  Top 0.254: +5V_SW1.1 10.17,64.76 R51.2
N$76
  Top 0.19: 44.93,35.19 C58.1
  Top 0.254: U10.P$15 46.58,33.53 44.93,35.19
N$77
  Top 0.254: U10.P$5 46.08,29.53 46.63,28.99 47.13,28.99 | L9.P$1 54.28,28.99 47.13,28.99 | U10.P$6 46.58,29.53 47.13,28.99
N$78
  Top 0.254: +3V3_SW3.1 R60.2
N$84
  Top 0.254: R49.2 82.23,81.6 +3V_BUS.1
N$85  (via drill 0.35)
  Top 0.19: M1.P$8 M1.P$7 M1.P$6 | M1.P$6 M1.P$5 | M1.P$6 16.29,11.17 M1.P$9
  Top 0.254: 16.6,11.5 16.1,11.5 M1.P$9
  Top 0.305: U2.P$4 15.91,17.39 17.8,15.5 17.8,12.7 16.6,11.5
  Top 0.406: 16,11.6 16.1,11.5
  Top 0.813: C1.1 26.74,11.64 C2.1 26.69,11.63 R1.2 22.14,11.63 C15.1 19.85,11.65 C16.1 16.08,11.62 M1.P$9 | 16,11.6 C4.1 12.42,8.7 v12.78,8.34
  Bottom 0.813: v12.78,8.34 14.08,8.34 L10.P$2
N$94
  Top 1.27: H1.P$4 8.89,85.98 R66.1
N$99
  Bottom 0.406: J5.1 85.68,14.26 D3.C 80.63,9.21 80.63,2.88 79.5,1.75 J4.1
  Bottom 0.61: R36.1 78.4,3.66 J4.1
SOLAR  (via drill 0.35)
  Top 0.61: J12.2 33.32,4.92 37.89,9.49 v57.63,9.49 59.04,9.49 D2.C
  Bottom 0.61: R34.1 R35.1 8.78,8.97 11.35,6.4 31.3,6.4 33.32,4.38 J12.2 | R36.2 R62.2 69.38,5.89 67.53,7.74 58.23,7.74 57.63,8.34 v57.63,9.49
SW1_PGOOD  (via drill 0.35)
  Top 0.254: v78.9,24.1 v78.91,24.09 R29.2 | U7.P$12 74.75,14.01 75.94,15.2 v76.35,15.2
  Bottom 0.254: v78.9,24.1 75.25,24.1 74.28,23.13 74.28,16.72 75.8,15.2 v76.35,15.2 77.1,15.95 78.65,15.95 79,15.6 79,13.55 78.65,13.2 58,13.2 57,12.2 57,10.6 56,9.6 U1.P$29
SW2_PGOOD  (via drill 0.35)
  Top 0.254: v57.2,15.3 37,15.3 36.4,15.9 36.4,40.3 32.7,44 21.5,44 20.6,44.9 20.6,52.3 19.4,53.5 14.1,53.5 13.3,54.3 v13.3,65.1 R21.2 | U5.P$12 18.51,75.31 17.74,74.54 17.25,74.54 v16.67,73.95
  Bottom 0.254: U1.P$28 55.7,12.1 57.2,13.6 v57.2,15.3 | v13.3,65.1 16.03,65.1 16.67,65.74 v16.67,73.95
SW3_PGOOD  (via drill 0.35)
  Top 0.254: U3.P$12 73.79,32.89 v74.9,34 | v78.4,43.1 v78.41,43.09 R13.2
  Bottom 0.254: v74.9,34 76.8,35.9 76.8,42.46 77.44,43.1 v78.4,43.1
SW3_V_SENSE  (via drill 0.35)
  Top 0.254: R44.1 75.31,41.72 R45.1 72.3,41.73 72.3,42.6 71.8,43.1 65.51,43.1 v64.82,42.41 | v41.4,14.6 41.8,14.2 61.15,14.2 62.15,15.2 62.15,28.15 61.2,29.1 v61.22,38.86
  Bottom 0.254: U1.P$4 v41.4,14.6 | v61.22,38.86 61.22,38.87 64.75,42.41 v64.82,42.41
V_BATT  (via drill 0.35)  (2 unrouted)
  Top 0.254: 26.83,37.58 D4.A | C40.1 76.33,13.01 74.78,13.01 | U7.P$10 74.78,13.01 | 26.85,41.55 26.85,41 | U7.P$9 74.28,12.51 74.78,13.01 | U8.P$10 U8.P$9 | U9.P$9 U9.P$10 33.95,49.82 33.97,49.8 | 33.13,46.14 33.88,46.14 | U10.P$9 U10.P$10 50.04,31.37 50.84,31.37 | C20.1 74.97,31.39 U3.P$9 U3.P$10 | C30.1 17.41,77.19 18.38,77.19 18.76,76.81 U5.P$9 U5.P$10
  Top 0.305: U2.P$12 19.49,24.49 v19.8,24.8 | U8.P$9 27.28,60.47 C50.1 28.32,61.09 34.27,61.09 34.83,60.52 34.83,57.89 34.33,57.39 22.58,57.39 v20.68,55.49 22.98,53.19 22.98,47.29 24.13,46.14 33.13,46.14 41.78,46.14 42.03,46.39 42.03,49.69 41.78,49.94 36.23,49.94 C55.1 33.97,49.8 33.49,49.32 U9.P$9 | v12.23,53.84 13.57,52.5 13.78,52.5 | 33.88,46.14 38.98,41.04 38.98,29.64 40.93,27.69 57.48,27.69 58.68,28.89 58.68,30.94 58.28,31.34 52.03,31.34 C60.1 50.84,31.37 | U10.P$9 49.54,30.87 50.04,31.37 | 26.83,37.79 26.83,37.58
  Top 0.406: C40.1 76.72,13.4 82.7,13.4 83.4,12.7 83.4,10.7 | C20.1 75.88,32.3 83.3,32.3 85.4,30.2 | C30.1 16.32,76.1 9.2,76.1 7.1,74 7.1,53 7.6,52.5 13.78,52.5 18.7,52.5 19.6,51.6 19.6,44 20.9,42.7 25.15,42.7 26.85,41 | H1.2.46 H1.2.45 | H1.2.45 71.11,87 79.75,87 80.45,86.3 82.75,86.3 83.8,85.25 83.8,77.9 85.43,76.27 85.43,73.13 87.57,70.99 J16.2 | H1.2.45 68.58,89.54 55.88,89.54 | H1.2.34 55.88,89.54 | 55.88,89.54 55.88,89.53 H1.2.33 | v18.68,42.89 19.93,41.64 22.98,41.64 26.83,37.79
  Top 0.61: v20.6,31.7 21.62,31.7 | 21.62,31.7 22.18,31.14 22.18,30.25 R8.2 | J14.2 85.4,46.51 85.4,30.2 85.4,12.7 83.4,10.7 80.25,7.55 73.52,7.55 69.88,11.19 64.28,11.19 62.77,12.7 36.6,12.7 35.1,14.2 35.1,39.4 31.5,43 28.5,43 26.85,41.35 26.85,41 D4.C 27.54,40.88 28.08,40.34 28.08,33.64 28.52,33.2 R46.1 | 21.62,31.7 24.99,31.7 25.73,32.44 25.73,34.69 | R7.2 25.33,35.09 25.73,34.69 | 25.73,34.69 25.73,36.48 26.83,37.58
  Bottom 0.305: v20.6,31.7 20.1,31.7 19.8,31.4 v19.8,24.8 | v12.23,53.84 12.18,53.89 12.18,54.99 12.68,55.49 v20.68,55.49 | 14.33,49.14 C79.1 | 18.18,49.09 C78.1
  Bottom 0.406: v18.68,42.89 18.23,43.34 C78.1 | C81.1 8.63,54.04 8.63,49.69 9.18,49.14 C80.1 14.33,49.14 | 18.18,49.09 C79.1
V_BATT_SENSE  (via drill 0.35)
  Top 0.254: R47.2 29.39,35.08 | R46.2 32.8,35 33.2,34.6 v33.2,20.3
  Top 0.61: 29.39,35.08 R46.2
  Bottom 0.254: v33.2,20.3 33.2,17.5 33.6,17.1 U1.P$5
V_BUS
  Top 0.254: U6.P$9 74.28,69.31 74.78,69.81 | 74.78,69.81 C35.1 | 74.78,69.81 U6.P$10 U6.P$11 | U4.P$9 74.02,50.59 74.52,51.09 | 74.52,51.09 C25.1 | 74.52,51.09 74.51,51.09 U4.P$10 U4.P$11
  Top 0.406: C25.1 76.54,51.49 J14.1 | C35.1 76.81,70.24 83.48,70.24 84.73,68.98 J16.1
  Top 0.61: J14.1 85.83,54.03 85.83,66.42 J16.1

### Text on the board
tPlace: BATT SAFE | BUS SAFE | VIN SAFE
tNames: TP4 / +3V3BUS | TP2 / +5V SW1 | TP5 / +5V BUS | TP3 / +12V SW1 | TP1 / +3V3 SW1
bNames: EPS Board Rev. 1.0 / SN: ______________